# EAGLE schematic A500R8 (EAGLE 7.6.0), part 1 of 2

## Sheet 1 of 9
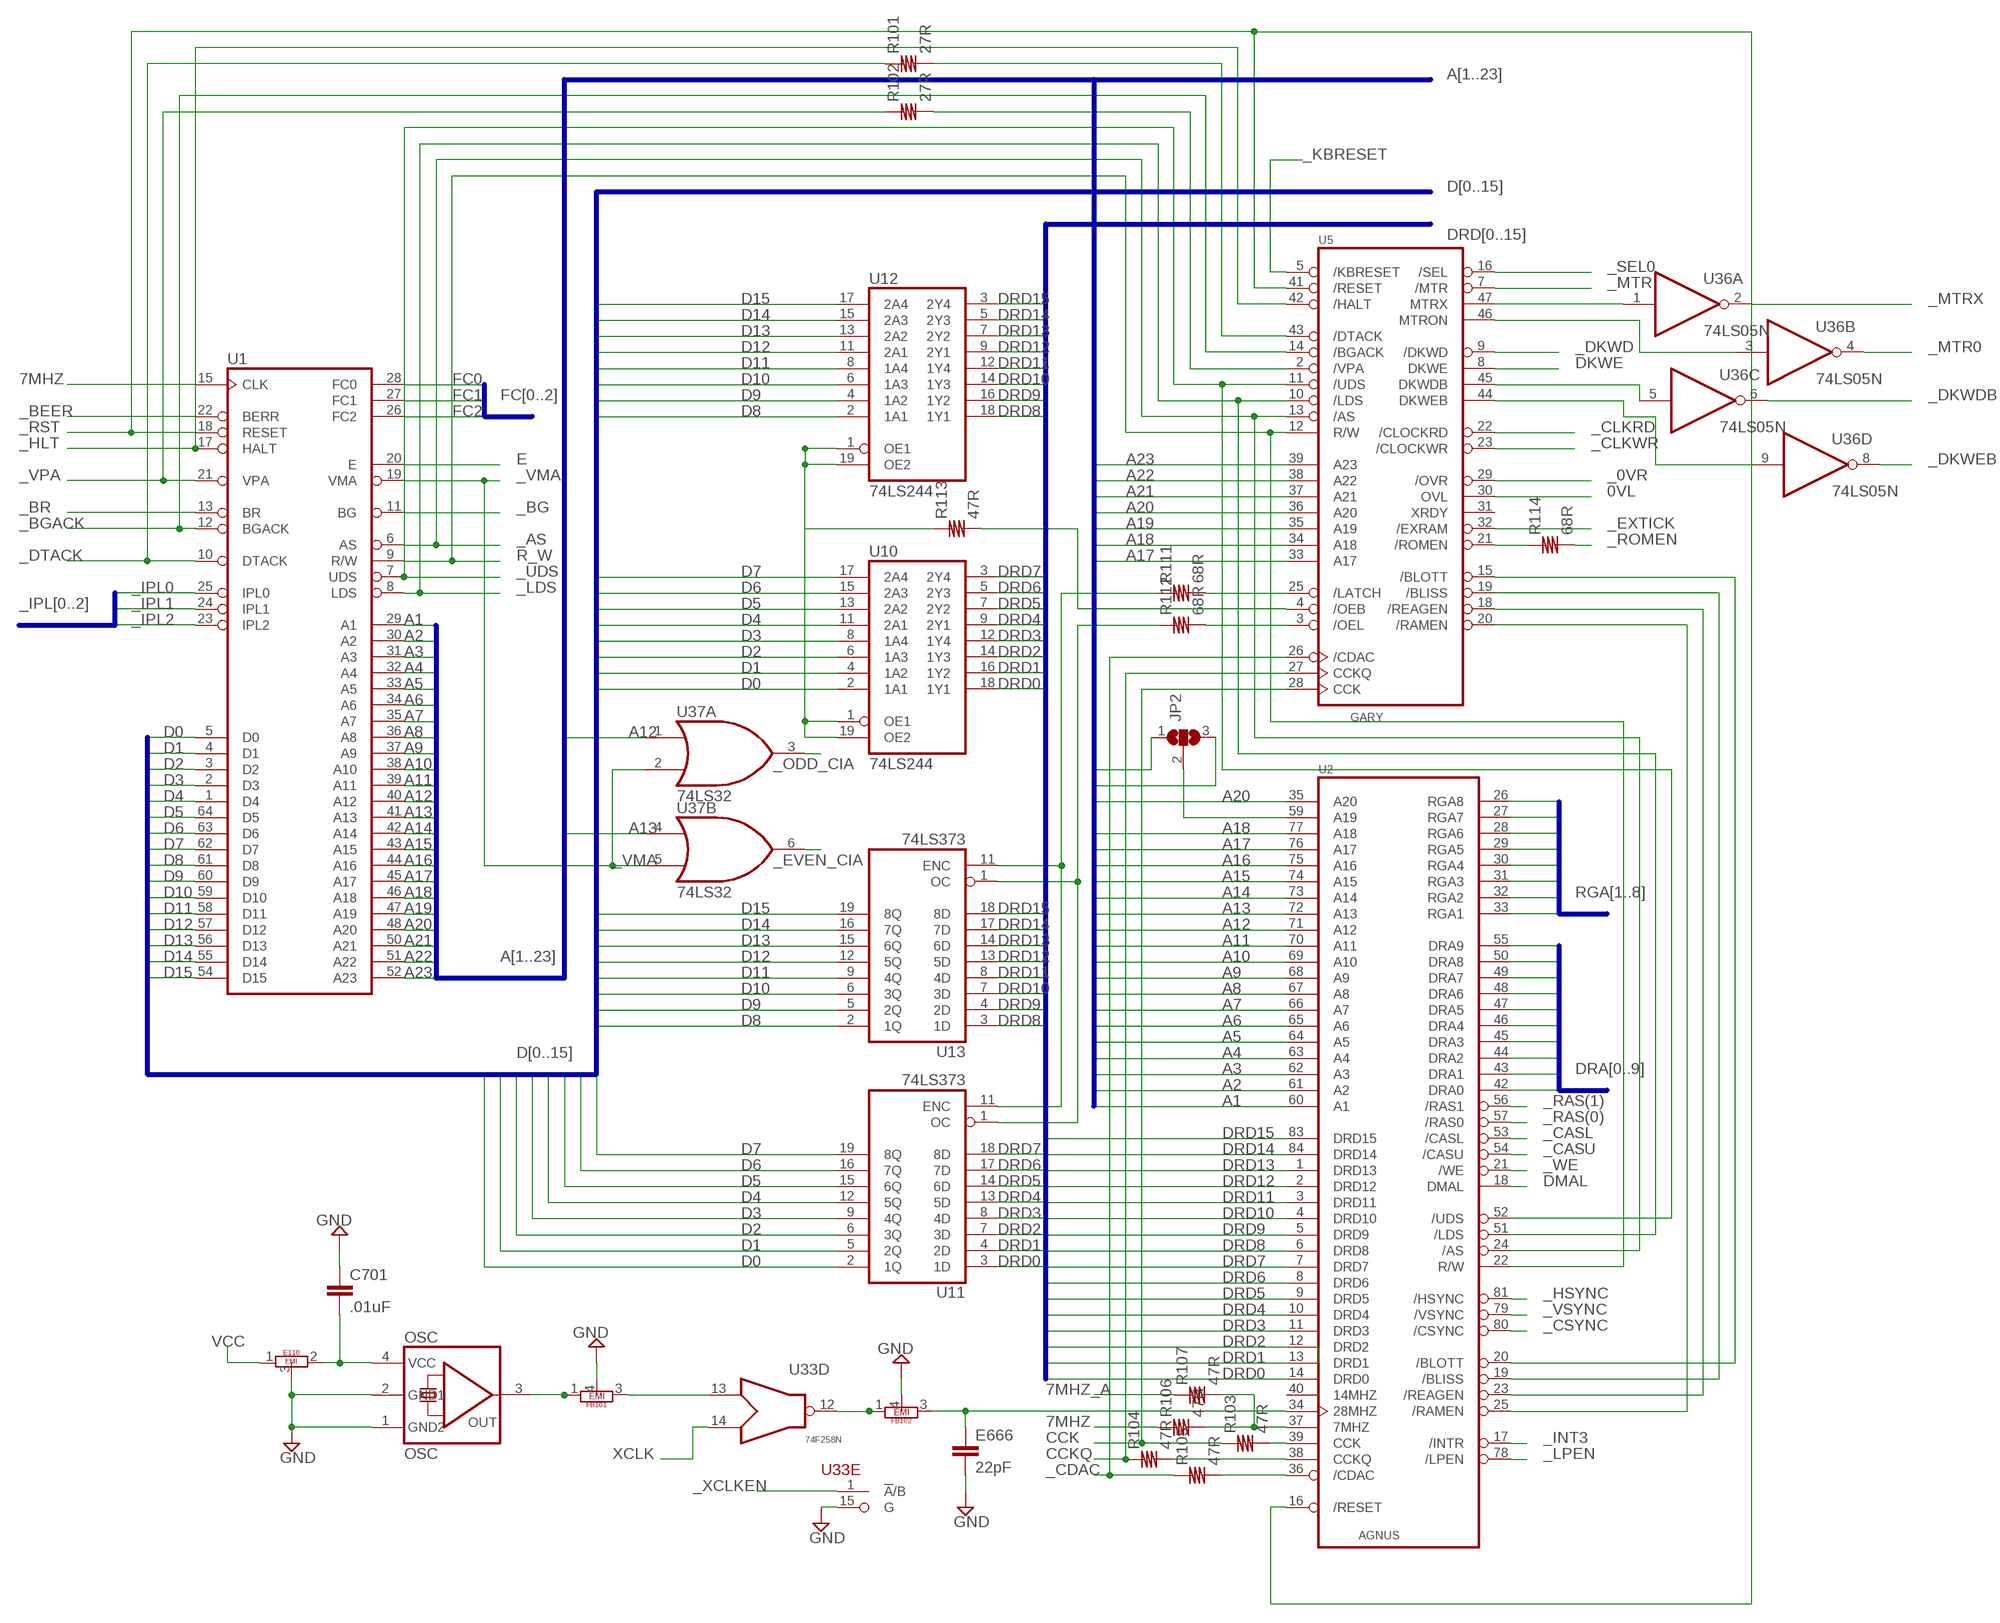
[diagram p0: schematic, sheet 1]

### Parts
C701  .01uF  C10/4  [C10B4]
E110  EMIFILTER  [EMIFILTER]
E666  22pF  C10/4  [C10B4]
FB101  68R  EMIFILTERLONG  [EMIFILTLONG]
FB102  150  EMIFILTERLONG  [EMIFILTLONG]
JP2  SJ2W  [SJ_2]
OSC  OSC  AMIGACRYSTAL  [AMIGACRYSTAL]
R101  27R  R10/4  [R10B4]
R102  27R  R10/4  [R10B4]
R103  47R  R10/4  [R10B4]
R104  47R  R10/4  [R10B4]
R105  47R  R10/4  [R10B4]
R106  47R  R10/4  [R10B4]
R107  47R  R10/4  [R10B4]
R111  68R  R10/4  [R10B4]
R112  68R  R10/4  [R10B4]
R113  47R  R10/4  [R10B4]
R114  68R  R10/4  [R10B4]
U1  MC68000P  [DIL64]
U2  AGNU8375  [PLCC84]
U5  GARY  [DIP48-6]
U10  74LS244  74LS373N  [DIL20]
U11  74LS373  74LS373N  [DIL20]
U12  74LS244  74LS373N  [DIL20]
U13  74LS373  74LS373N  [DIL20]
U33  74F258N  [DIL16]
U36  74LS05N  [DIL14]
U37  74LS32  74LS32N  [DIL14]

### Nets
0VL: U5.30(OVL) ; also sheet 5,8
7MHZ: R106.1 U1.15(CLK) ; also sheet 8,9
7MHZ_A: R107.1 ; also sheet 3,9
_0VR: U5.29(/OVR) ; also sheet 8
_AS: U1.6(AS) U2.24(/AS) U5.13(/AS) ; also sheet 8
_BEER: U1.22(BERR) ; also sheet 8
_BG: U1.11(BG) ; also sheet 8
_BGACK: U1.12(BGACK) U5.14(/BGACK) ; also sheet 8
_BR: U1.13(BR) ; also sheet 8
_CASL: U2.53(/CASL) ; also sheet 2
_CASU: U2.54(/CASU) ; also sheet 2
_CDAC: R105.1 U5.26(/CDAC) ; also sheet 3,8,9
_CLKRD: U5.22(/CLOCKRD) ; also sheet 7
_CLKWR: U5.23(/CLOCKWR) ; also sheet 7
_CSYNC: U2.80(/CSYNC) ; also sheet 3
_DKWD: U5.9(/DKWD) ; also sheet 4
_DKWDB: U36.6(C:O) ; also sheet 6
_DKWEB: U36.8(D:O) ; also sheet 6
_DTACK: R101.1 U1.10(DTACK) ; also sheet 8
_EVEN_CIA: U37.6(B:O) ; also sheet 5
_EXTICK: U5.32(/EXRAM) ; also sheet 5,7,8
_HLT: U1.17(HALT) U5.42(/HALT) ; also sheet 8
_HSYNC: U2.81(/HSYNC) ; also sheet 3,5
_INT3: U2.17(/INTR) ; also sheet 4
_IPL0: U1.25(IPL0) ; also sheet 4,8
_IPL1: U1.24(IPL1) ; also sheet 4,8
_IPL2: U1.23(IPL2) ; also sheet 4,8
_KBRESET: U5.5(/KBRESET) ; also sheet 6
_LDS: U1.8(LDS) U2.51(/LDS) U5.10(/LDS) ; also sheet 8
_LPEN: U2.78(/LPEN) ; also sheet 4
_MTR: U5.7(/MTR) ; also sheet 5
_MTR0: U36.4(B:O) ; also sheet 6
_MTRX: U36.2(A:O) ; also sheet 6
_ODD_CIA: U37.3(A:O) ; also sheet 5
_RAS(0): U2.57(/RAS0) ; also sheet 2
_RAS(1): U2.56(/RAS1) ; also sheet 2
_ROMEN: R114.2 ; also sheet 7
_RST: U1.18(RESET) U2.16(/RESET) U5.41(/RESET) ; also sheet 4,8
_SEL0: U5.16(/SEL) ; also sheet 5,6
_UDS: U1.7(UDS) U2.52(/UDS) U5.11(/UDS) ; also sheet 8
_VMA: U1.19(VMA) U37.2(A:I1) U37.5(B:I1) ; also sheet 8
_VPA: R102.1 U1.21(VPA) ; also sheet 8
_VSYNC: U2.79(/VSYNC) ; also sheet 3,5
_WE: U2.21(/WE) ; also sheet 2
_XCLKEN: U33.1(E:!A!/B) ; also sheet 3
A1: U1.29(A1) U2.60(A1) ; also sheet 7,8
A2: U1.30(A2) U2.61(A2) ; also sheet 7,8
A3: U1.31(A3) U2.62(A3) ; also sheet 7,8
A4: U1.32(A4) U2.63(A4) ; also sheet 7,8
A5: U1.33(A5) U2.64(A5) ; also sheet 7,8
A6: U1.34(A6) U2.65(A6) ; also sheet 7,8
A7: U1.35(A7) U2.66(A7) ; also sheet 7,8
A8: U1.36(A8) U2.67(A8) ; also sheet 5,7,8
A9: U1.37(A9) U2.68(A9) ; also sheet 5,7,8
A10: U1.38(A10) U2.69(A10) ; also sheet 5,7,8
A11: U1.39(A11) U2.70(A11) ; also sheet 5,7,8
A12: U1.40(A12) U2.71(A12) U37.1(A:I0) ; also sheet 7,8
A13: U1.41(A13) U2.72(A13) U37.4(B:I0) ; also sheet 7,8
A14: U1.42(A14) U2.73(A14) ; also sheet 7,8
A15: U1.43(A15) U2.74(A15) ; also sheet 7,8
A16: U1.44(A16) U2.75(A16) ; also sheet 7,8
A17: U1.45(A17) U2.76(A17) U5.33(A17) ; also sheet 7,8
A18: U1.46(A18) U2.77(A18) U5.34(A18) ; also sheet 7,8
A19: JP2.3 U1.47(A19) U5.35(A19) ; also sheet 7,8
A20: U1.48(A20) U2.35(A20) U5.36(A20) ; also sheet 7,8
A21: U1.50(A21) U5.37(A21) ; also sheet 8
A22: U1.51(A22) U5.38(A22) ; also sheet 8
A23: JP2.1 U1.52(A23) U5.39(A23) ; also sheet 8
CCK: R103.1 U5.28(CCK) ; also sheet 2,3,4,8,9
CCKQ: R104.1 U5.27(CCKQ) ; also sheet 4,8,9
D0: U1.5(D0) U10.2(1A1) U11.2(1Q) ; also sheet 5,7,8
D1: U1.4(D1) U10.4(1A2) U11.5(2Q) ; also sheet 5,7,8
D2: U1.3(D2) U10.6(1A3) U11.6(3Q) ; also sheet 5,7,8
D3: U1.2(D3) U10.8(1A4) U11.9(4Q) ; also sheet 5,7,8
D4: U1.1(D4) U10.11(2A1) U11.12(5Q) ; also sheet 5,7,8
D5: U1.64(D5) U10.13(2A2) U11.15(6Q) ; also sheet 5,7,8
D6: U1.63(D6) U10.15(2A3) U11.16(7Q) ; also sheet 5,7,8
D7: U1.62(D7) U10.17(2A4) U11.19(8Q) ; also sheet 5,7,8
D8: U1.61(D8) U12.2(1A1) U13.2(1Q) ; also sheet 5,7,8
D9: U1.60(D9) U12.4(1A2) U13.5(2Q) ; also sheet 5,7,8
D10: U1.59(D10) U12.6(1A3) U13.6(3Q) ; also sheet 5,7,8
D11: U1.58(D11) U12.8(1A4) U13.9(4Q) ; also sheet 5,7,8
D12: U1.57(D12) U12.11(2A1) U13.12(5Q) ; also sheet 5,7,8
D13: U1.56(D13) U12.13(2A2) U13.15(6Q) ; also sheet 5,7,8
D14: U1.55(D14) U12.15(2A3) U13.16(7Q) ; also sheet 5,7,8
D15: U1.54(D15) U12.17(2A4) U13.19(8Q) ; also sheet 5,7,8
DKWE: U5.8(DKWE) ; also sheet 4
DMAL: U2.18(DMAL) ; also sheet 4
DRA0: U2.42(DRA0) ; also sheet 2
DRA1: U2.43(DRA1) ; also sheet 2
DRA2: U2.44(DRA2) ; also sheet 2
DRA3: U2.45(DRA3) ; also sheet 2
DRA4: U2.46(DRA4) ; also sheet 2
DRA5: U2.47(DRA5) ; also sheet 2
DRA6: U2.48(DRA6) ; also sheet 2
DRA7: U2.49(DRA7) ; also sheet 2
DRA8: U2.50(DRA8) ; also sheet 2
DRA9: U2.55(DRA9) ; also sheet 2
DRD0: U2.14(DRD0) U10.18(1Y1) U11.3(1D) ; also sheet 2,3,4,7,8
DRD1: U2.13(DRD1) U10.16(1Y2) U11.4(2D) ; also sheet 2,3,4,7,8
DRD2: U2.12(DRD2) U10.14(1Y3) U11.7(3D) ; also sheet 2,3,4,7,8
DRD3: U2.11(DRD3) U10.12(1Y4) U11.8(4D) ; also sheet 2,3,4,7,8
DRD4: U2.10(DRD4) U10.9(2Y1) U11.13(5D) ; also sheet 2,3,4,7,8
DRD5: U2.9(DRD5) U10.7(2Y2) U11.14(6D) ; also sheet 2,3,4,7,8
DRD6: U2.8(DRD6) U10.5(2Y3) U11.17(7D) ; also sheet 2,3,4,7,8
DRD7: U2.7(DRD7) U10.3(2Y4) U11.18(8D) ; also sheet 2,3,4,7,8
DRD8: U2.6(DRD8) U12.18(1Y1) U13.3(1D) ; also sheet 2,3,4,7,8
DRD9: U2.5(DRD9) U12.16(1Y2) U13.4(2D) ; also sheet 2,3,4,7,8
DRD10: U2.4(DRD10) U12.14(1Y3) U13.7(3D) ; also sheet 2,3,4,7,8
DRD11: U2.3(DRD11) U12.12(1Y4) U13.8(4D) ; also sheet 2,3,4,7,8
DRD12: U2.2(DRD12) U12.9(2Y1) U13.13(5D) ; also sheet 2,3,4,7,8
DRD13: U2.1(DRD13) U12.7(2Y2) U13.14(6D) ; also sheet 2,3,4,7,8
DRD14: U2.84(DRD14) U12.5(2Y3) U13.17(7D) ; also sheet 2,3,4,7,8
DRD15: U2.83(DRD15) U12.3(2Y4) U13.18(8D) ; also sheet 2,3,4,7,8
E: U1.20(E) ; also sheet 5,8
FC0: U1.28(FC0) ; also sheet 8
FC1: U1.27(FC1) ; also sheet 8
FC2: U1.26(FC2) ; also sheet 8
GND: C701.1 E110.3 E666.2 FB101.4 FB102.4 OSC.1(GND2) OSC.2(GND1) U33.15(E:G) ; also sheet 2,3,4,5,6,7,8,9
N$1: R113.1 U10.1(OE1) U10.19(OE2) U12.1(OE1) U12.19(OE2)
N$2: R113.2 U5.4(/OEB)
N$3: R112.1 U11.1(OC) U13.1(OC)
N$4: R112.2 U5.3(/OEL)
N$5: R111.1 U11.11(ENC) U13.11(ENC)
N$6: R111.2 U5.25(/LATCH)
N$7: R102.2 U5.2(/VPA)
N$8: R114.1 U5.21(/ROMEN)
N$9: U5.47(MTRX) U36.1(A:I)
N$10: R101.2 U5.43(/DTACK)
N$11: R106.2 R107.2 U2.37(7MHZ)
N$12: R103.2 U2.39(CCK)
N$13: R104.2 U2.38(CCKQ)
N$14: R105.2 U2.36(/CDAC)
N$15: U2.20(/BLOTT) U5.15(/BLOTT)
N$16: U2.19(/BLISS) U5.19(/BLISS)
N$17: U2.23(/REAGEN) U5.18(/REAGEN)
N$18: U2.25(/RAMEN) U5.20(/RAMEN)
N$19: E666.1 FB102.3 U2.34(28MHZ)
N$20: JP2.2 U2.59(A19)
N$192: U5.46(MTRON) U36.3(B:I)
N$198: U5.45(DKWDB) U36.5(C:I)
N$203: U5.44(DKWEB) U36.9(D:I)
N$232: FB102.1 FB102.2 U33.12(D:O)
N$236: FB101.1 FB101.2 OSC.3(OUT)
N$237: FB101.3 U33.13(D:I0)
N$254: C701.2 E110.2 OSC.4(VCC)
R_W: U1.9(R/W) U2.22(R/W) U5.12(R/W) ; also sheet 5,8
RGA1: U2.33(RGA1) ; also sheet 3,4
RGA2: U2.32(RGA2) ; also sheet 3,4
RGA3: U2.31(RGA3) ; also sheet 3,4
RGA4: U2.30(RGA4) ; also sheet 3,4
RGA5: U2.29(RGA5) ; also sheet 3,4
RGA6: U2.28(RGA6) ; also sheet 3,4
RGA7: U2.27(RGA7) ; also sheet 3,4
RGA8: U2.26(RGA8) ; also sheet 3,4
VCC: E110.1 ; also sheet 2,3,4,5,6,7,8,9
XCLK: U33.14(D:I1) ; also sheet 3
Unconnected: U2.40(14MHZ) U5.31(XRDY)

### Buses
_IPL[0..2]
FC[0..2]
D[0..15]
A[1..23]
DRD[0..15]
RGA[1..8]
DRA[0..9]

## Sheet 2 of 9
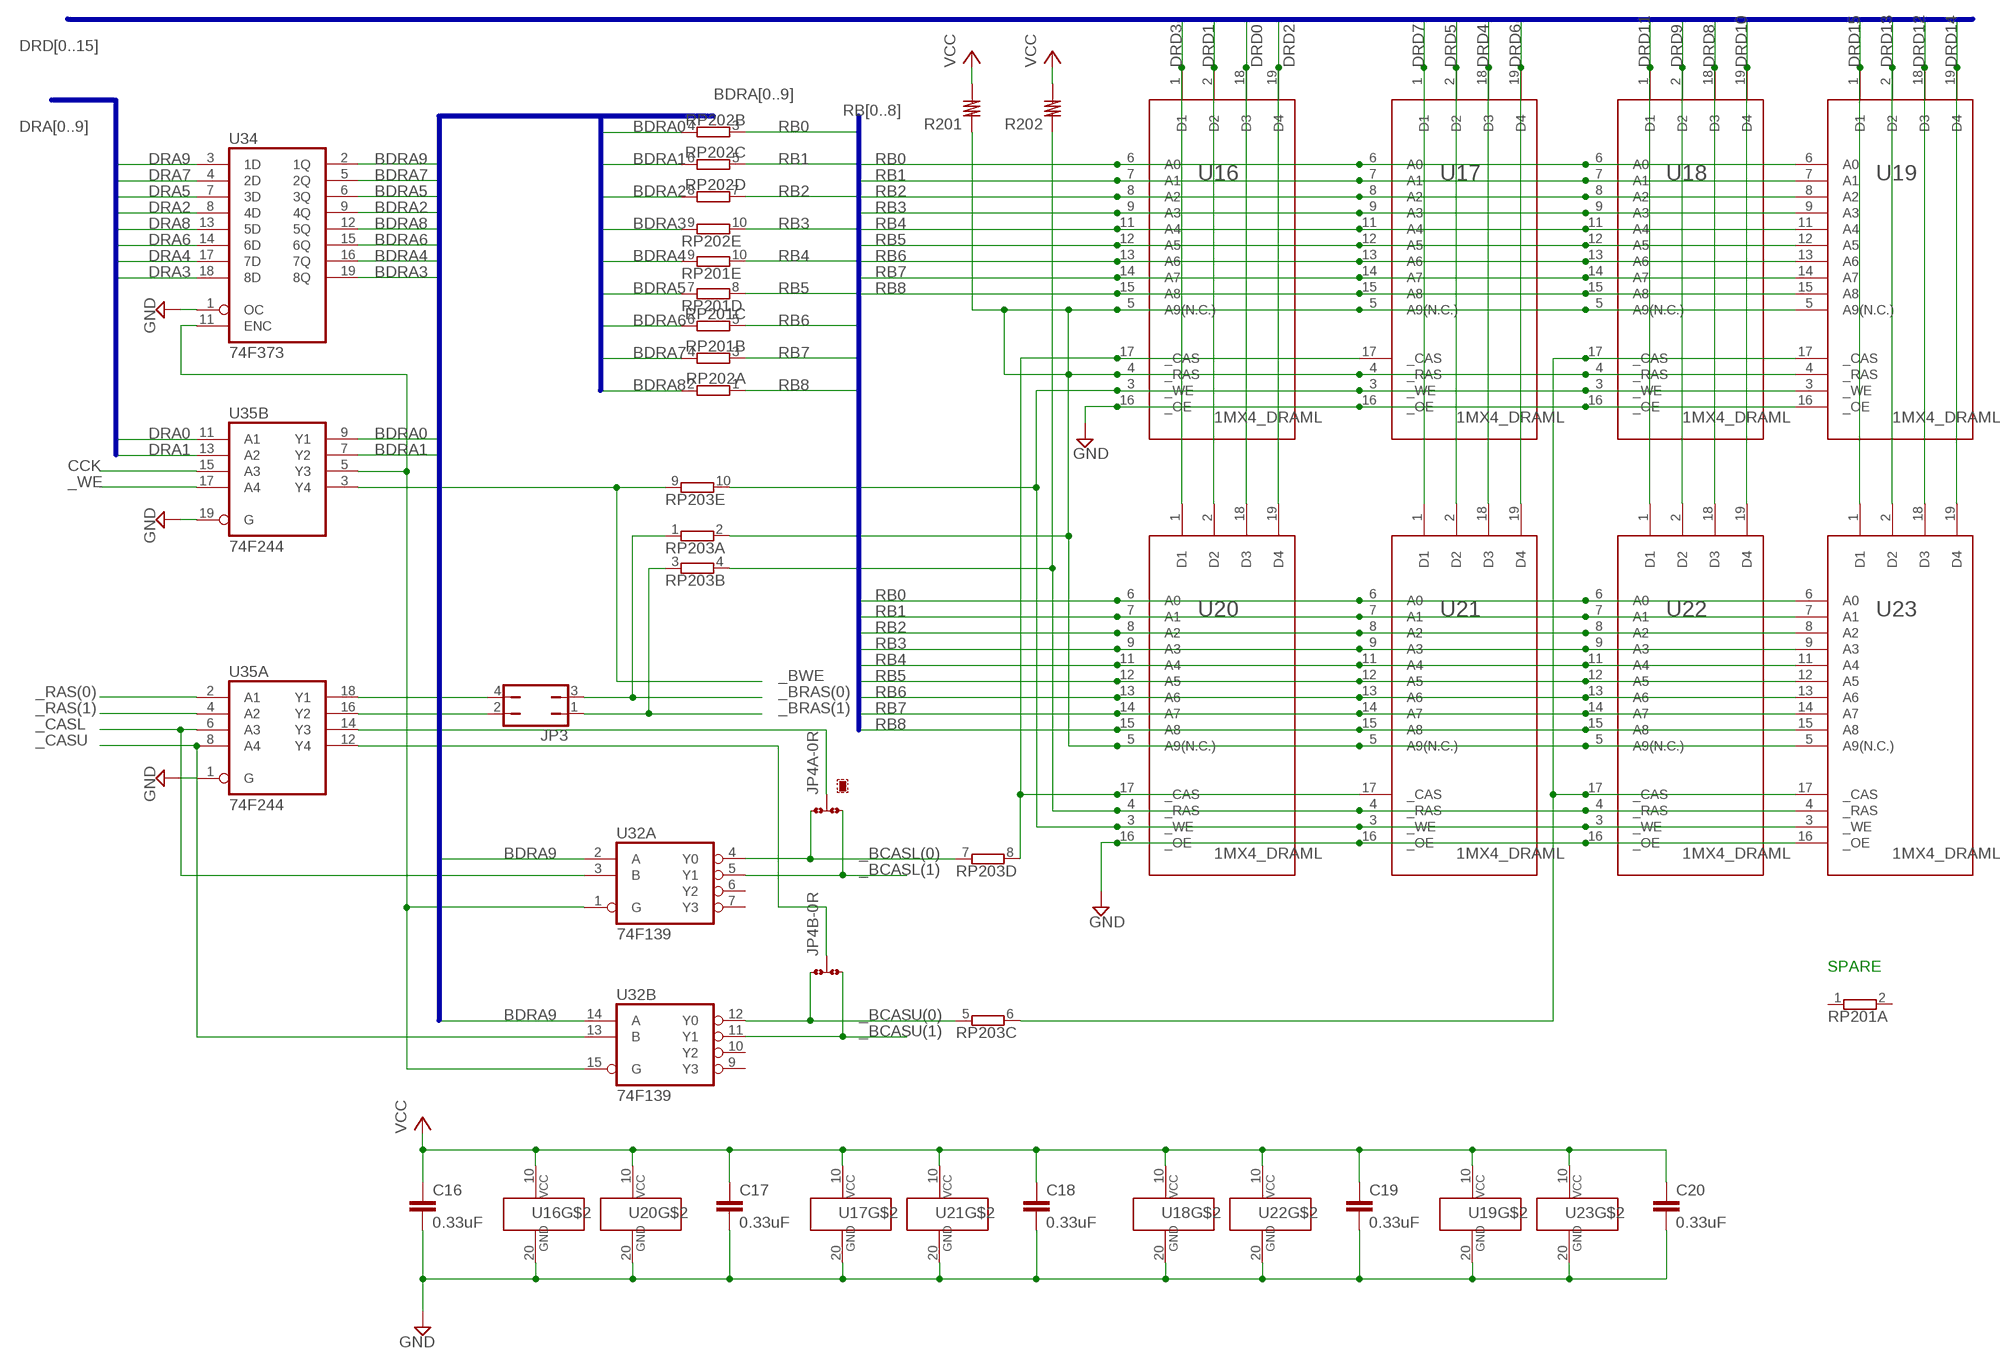
[diagram p1: schematic, sheet 2]

### Parts
C16  0.33uF  C10/4  [C10B4]
C17  0.33uF  C10/4  [C10B4]
C18  0.33uF  C10/4  [C10B4]
C19  0.33uF  C10/4  [C10B4]
C20  0.33uF  C10/4  [C10B4]
JP3  JP2Q  [JP2Q]
JP4A  JP4A  0R-JUMPA  [A0R-JMP]
JP4B  JP4B  0R-JUMPA  [A0R-JMP]
R201  R10/4  [R10B4]
R202  R10/4  [R10B4]
RP201  E5R  [SIL10]
RP202  E5R  [SIL10]
RP203  E5R  [SIL10]
U16  1MX4_DRAML  [DIL20]
U17  1MX4_DRAML  [DIL20]
U18  1MX4_DRAML  [DIL20]
U19  1MX4_DRAML  [DIL20]
U20  1MX4_DRAML  [DIL20]
U21  1MX4_DRAML  [DIL20]
U22  1MX4_DRAML  [DIL20]
U23  1MX4_DRAML  [DIL20]
U32  74F139  74S139N  [DIL16]
U34  74F373  74LS373N  [DIL20]
U35  74F244  74S244N  [DIL20]

### Nets
_BCASL(0): JP4A.1 RP203.7 U32.4(A:Y0)
_BCASL(1): JP4A.3 U32.5(A:Y1) ; also sheet 7
_BCASU(0): JP4B.1 RP203.5 U32.12(B:Y0)
_BCASU(1): JP4B.3 U32.11(B:Y1) ; also sheet 7
_BRAS(0): JP3.3 RP203.1 ; also sheet 7
_BRAS(1): JP3.1 RP203.3 ; also sheet 7
_BWE: RP203.9 U35.3(B:Y4) ; also sheet 7
_CASL: U32.3(A:B) U35.6(A:A3) ; also sheet 1
_CASU: U32.13(B:B) U35.8(A:A4) ; also sheet 1
_RAS(0): U35.2(A:A1) ; also sheet 1
_RAS(1): U35.4(A:A2) ; also sheet 1
_WE: U35.17(B:A4) ; also sheet 1
BDRA0: RP202.4 U35.9(B:Y1) ; also sheet 7
BDRA1: RP202.6 U35.7(B:Y2) ; also sheet 7
BDRA2: RP202.8 U34.9(4Q) ; also sheet 7
BDRA3: RP202.9 U34.19(8Q) ; also sheet 7
BDRA4: RP201.9 U34.16(7Q) ; also sheet 7
BDRA5: RP201.7 U34.6(3Q) ; also sheet 7
BDRA6: RP201.6 U34.15(6Q) ; also sheet 7
BDRA7: RP201.4 U34.5(2Q) ; also sheet 7
BDRA8: RP202.2 U34.12(5Q) ; also sheet 7
BDRA9: U32.2(A:A) U32.14(B:A) U34.2(1Q)
CCK: U35.15(B:A3) ; also sheet 1,3,4,8,9
DRA0: U35.11(B:A1) ; also sheet 1
DRA1: U35.13(B:A2) ; also sheet 1
DRA2: U34.8(4D) ; also sheet 1
DRA3: U34.18(8D) ; also sheet 1
DRA4: U34.17(7D) ; also sheet 1
DRA5: U34.7(3D) ; also sheet 1
DRA6: U34.14(6D) ; also sheet 1
DRA7: U34.4(2D) ; also sheet 1
DRA8: U34.13(5D) ; also sheet 1
DRA9: U34.3(1D) ; also sheet 1
DRD0: U16.18(D3) U20.18(D3) ; also sheet 1,3,4,7,8
DRD1: U16.2(D2) U20.2(D2) ; also sheet 1,3,4,7,8
DRD2: U16.19(D4) U20.19(D4) ; also sheet 1,3,4,7,8
DRD3: U16.1(D1) U20.1(D1) ; also sheet 1,3,4,7,8
DRD4: U17.18(D3) U21.18(D3) ; also sheet 1,3,4,7,8
DRD5: U17.2(D2) U21.2(D2) ; also sheet 1,3,4,7,8
DRD6: U17.19(D4) U21.19(D4) ; also sheet 1,3,4,7,8
DRD7: U17.1(D1) U21.1(D1) ; also sheet 1,3,4,7,8
DRD8: U18.18(D3) U22.18(D3) ; also sheet 1,3,4,7,8
DRD9: U18.2(D2) U22.2(D2) ; also sheet 1,3,4,7,8
DRD10: U18.19(D4) U22.19(D4) ; also sheet 1,3,4,7,8
DRD11: U18.1(D1) U22.1(D1) ; also sheet 1,3,4,7,8
DRD12: U19.18(D3) U23.18(D3) ; also sheet 1,3,4,7,8
DRD13: U19.2(D2) U23.2(D2) ; also sheet 1,3,4,7,8
DRD14: U19.19(D4) U23.19(D4) ; also sheet 1,3,4,7,8
DRD15: U19.1(D1) U23.1(D1) ; also sheet 1,3,4,7,8
GND: C16.2 C17.2 C18.2 C19.2 C20.2 U16.16(_OE) U16.20(GND1) U17.16(_OE) U17.20(GND1) U18.16(_OE) U18.20(GND1) U19.16(_OE) U19.20(GND1) U20.16(_OE) U20.20(GND1) U21.16(_OE) U21.20(GND1) U22.16(_OE) U22.20(GND1) U23.16(_OE) U23.20(GND1) U34.1(OC) U35.1(A:G) U35.19(B:G) ; also sheet 1,3,4,5,6,7,8,9
N$21: U32.1(A:G) U32.15(B:G) U34.11(ENC) U35.5(B:Y3)
N$22: JP3.4 U35.18(A:Y1)
N$23: JP3.2 U35.16(A:Y2)
N$24: JP4A.2 U35.14(A:Y3)
N$25: JP4B.2 U35.12(A:Y4)
N$26: R202.1 RP203.4 U20.4(_RAS) U21.4(_RAS) U22.4(_RAS) U23.4(_RAS)
N$27: RP203.6 U18.17(_CAS) U19.17(_CAS) U22.17(_CAS) U23.17(_CAS)
N$28: RP203.8 U16.17(_CAS) U17.17(_CAS) U20.17(_CAS) U21.17(_CAS)
N$29: RP203.10 U16.3(_WE) U17.3(_WE) U18.3(_WE) U19.3(_WE) U20.3(_WE) U21.3(_WE) U22.3(_WE) U23.3(_WE)
N$30: R201.1 RP203.2 U16.4(_RAS) U16.5(A9(N.C.)) U17.4(_RAS) U17.5(A9(N.C.)) U18.4(_RAS) U18.5(A9(N.C.)) U19.4(_RAS) U19.5(A9(N.C.)) U20.5(A9(N.C.)) U21.5(A9(N.C.)) U22.5(A9(N.C.)) U23.5(A9(N.C.))
RB0: RP202.3 U16.6(A0) U17.6(A0) U18.6(A0) U19.6(A0) U20.6(A0) U21.6(A0) U22.6(A0) U23.6(A0)
RB1: RP202.5 U16.7(A1) U17.7(A1) U18.7(A1) U19.7(A1) U20.7(A1) U21.7(A1) U22.7(A1) U23.7(A1)
RB2: RP202.7 U16.8(A2) U17.8(A2) U18.8(A2) U19.8(A2) U20.8(A2) U21.8(A2) U22.8(A2) U23.8(A2)
RB3: RP202.10 U16.9(A3) U17.9(A3) U18.9(A3) U19.9(A3) U20.9(A3) U21.9(A3) U22.9(A3) U23.9(A3)
RB4: RP201.10 U16.11(A4) U17.11(A4) U18.11(A4) U19.11(A4) U20.11(A4) U21.11(A4) U22.11(A4) U23.11(A4)
RB5: RP201.8 U16.12(A5) U17.12(A5) U18.12(A5) U19.12(A5) U20.12(A5) U21.12(A5) U22.12(A5) U23.12(A5)
RB6: RP201.5 U16.13(A6) U17.13(A6) U18.13(A6) U19.13(A6) U20.13(A6) U21.13(A6) U22.13(A6) U23.13(A6)
RB7: RP201.3 U16.14(A7) U17.14(A7) U18.14(A7) U19.14(A7) U20.14(A7) U21.14(A7) U22.14(A7) U23.14(A7)
RB8: RP202.1 U16.15(A8) U17.15(A8) U18.15(A8) U19.15(A8) U20.15(A8) U21.15(A8) U22.15(A8) U23.15(A8)
VCC: C16.1 C17.1 C18.1 C19.1 C20.1 R201.2 R202.2 U16.10(VCC1) U17.10(VCC1) U18.10(VCC1) U19.10(VCC1) U20.10(VCC1) U21.10(VCC1) U22.10(VCC1) U23.10(VCC1) ; also sheet 1,3,4,5,6,7,8,9
Unconnected: RP201.1 RP201.2 U32.6(A:Y2) U32.7(A:Y3) U32.9(B:Y3) U32.10(B:Y2)

### Buses
DRA[0..9]
DRD[0..15]
BDRA[0..9]
RB[0..8]

### Notes on the sheet
- SPARE

## Sheet 3 of 9
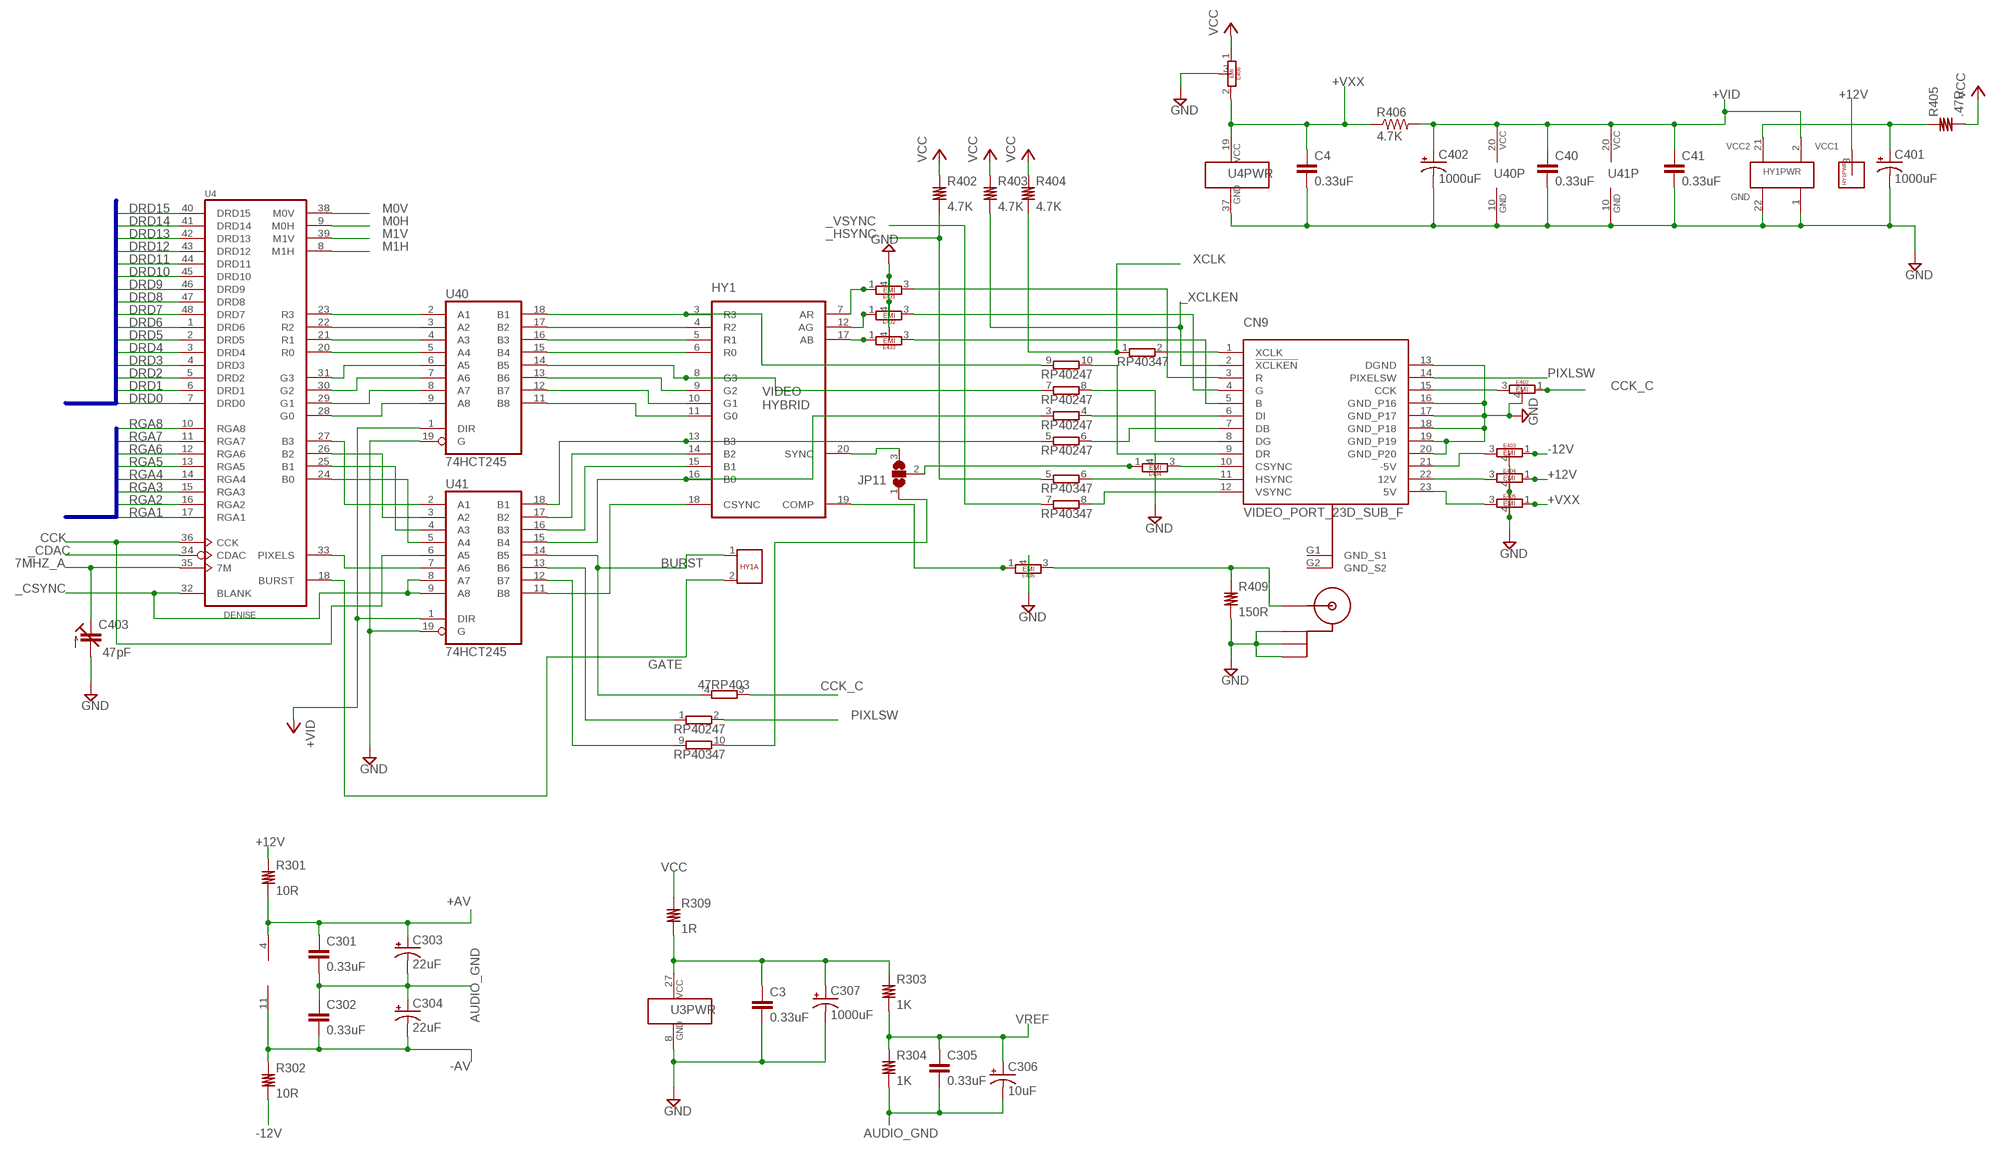
[diagram p2: schematic, sheet 3]

### Parts
C3  0.33uF  C10/4  [C10B4]
C4  0.33uF  C10/4  [C10B4]
C40  0.33uF  C10/4  [C10B4]
C41  0.33uF  C10/4  [C10B4]
C301  0.33uF  C10/4  [C10B4]
C302  0.33uF  C10/4  [C10B4]
C303  22uF  CPOL-USE5-6  [E5-6]
C304  22uF  CPOL-USE5-6  [E5-6]
C305  0.33uF  C10/4  [C10B4]
C306  10uF  CPOL-USE5-6  [E5-6]
C307  1000uF  CPOL-USE5-6  [E5-6]
C401  1000uF  CPOL-USE5-10.5  [E5-10,5]
C402  1000uF  CPOL-USE5-10.5  [E5-10,5]
C403  47pF  C-TRIMM3050.504  [CTRIM3050.504]
CN9  VIDEO_PORT_23D_SUB_F  [F23H_FC]
CN10  CINCH  [CINCH-B]
E402  150pF  EMIFILTERLONG  [EMIFILTLONG]
E403  EMIFILTERLONG  [EMIFILTLONG]
E404  EMIFILTERLONG  [EMIFILTLONG]
E405  EMIFILTERLONG  [EMIFILTLONG]
E406  EMIFILTER  [EMIFILTER]
E431  EMIFILTERLONG  [EMIFILTLONG]
E432  EMIFILTERLONG  [EMIFILTLONG]
E433  EMIFILTERLONG  [EMIFILTLONG]
E434  EMIFILTERLONG  [EMIFILTLONG]
E435  EMIFILTERLONG  [EMIFILTLONG]
HY1  HY1  VIDEO_H  [SIP22]
JP11  SJ2W  [SJ_2]
R301  10R  R10/4  [R10B4]
R302  10R  R10/4  [R10B4]
R303  1K  R10/4  [R10B4]
R304  1K  R10/4  [R10B4]
R309  1R  R10/4  [R10B4]
R402  4.7K  R10/4  [R10B4]
R403  4.7K  R10/4  [R10B4]
R404  4.7K  R10/4  [R10B4]
R405  .47R  R10/4  [R10B4]
R406  4.7K  R-US_0207/10  [0207/10]
R409  150R  R10/4  [R10B4]
RP402  47  E5RP  [SIL10]
RP403  47  E5RP  [SIL10]
U3  PAULA_DIP  [DIP48-6]
U4  DENISE HR  DENISE_DIP  [DIP48-6]
U14  LF347/TL084  ICL7641P  [DIL14]
U40  74HCT245  74LS245N  [DIL20]
U41  74HCT245  74LS245N  [DIL20]
U$1  HY1A  [HY1A]

### Nets
7MHZ_A: C403.1(E) U4.35(7M) ; also sheet 1,9
+12V: E404.1 E404.2 R301.1 U$1.3 ; also sheet 5,6,7,8,9
+AV: C301.1 C303.+ R301.2 U14.4(P:V+) ; also sheet 4
+VID: C40.1 C41.1 C402.+ HY1.2(VCC) R406.2 U40.1(DIR) U40.20(VCC) U41.1(DIR) U41.20(VCC)
+VXX: C4.1 E405.1 E405.2 E406.2 R406.1 U4.19(VCC1)
-12V: E403.1 E403.2 R302.2 ; also sheet 4,5,7,8,9
-AV: C302.2 C304.- R302.1 U14.11(P:V-) ; also sheet 4
_CDAC: U4.34(CDAC) ; also sheet 1,8,9
_CSYNC: U4.32(BLANK) U41.8(A7) U41.9(A8) ; also sheet 1
_HSYNC: R402.2 RP403.5 ; also sheet 1,5
_VSYNC: RP403.7 ; also sheet 1,5
_XCLKEN: CN9.2(!XCLKEN!) R403.2 ; also sheet 1
AUDIO_GND: C301.2 C302.1 C303.- C304.+ C305.2 C306.- R304.2 ; also sheet 4
BURST: RP403.4 U41.14(B5) U$1.1
CCK: U4.36(CCK) U41.6(A5) ; also sheet 1,2,4,8,9
CCK_C: E402.1 E402.2 RP403.3
DRD0: U4.7(DRD0) ; also sheet 1,2,4,7,8
DRD1: U4.6(DRD1) ; also sheet 1,2,4,7,8
DRD2: U4.5(DRD2) ; also sheet 1,2,4,7,8
DRD3: U4.4(DRD3) ; also sheet 1,2,4,7,8
DRD4: U4.3(DRD4) ; also sheet 1,2,4,7,8
DRD5: U4.2(DRD5) ; also sheet 1,2,4,7,8
DRD6: U4.1(DRD6) ; also sheet 1,2,4,7,8
DRD7: U4.48(DRD7) ; also sheet 1,2,4,7,8
DRD8: U4.47(DRD8) ; also sheet 1,2,4,7,8
DRD9: U4.46(DRD9) ; also sheet 1,2,4,7,8
DRD10: U4.45(DRD10) ; also sheet 1,2,4,7,8
DRD11: U4.44(DRD11) ; also sheet 1,2,4,7,8
DRD12: U4.43(DRD12) ; also sheet 1,2,4,7,8
DRD13: U4.42(DRD13) ; also sheet 1,2,4,7,8
DRD14: U4.41(DRD14) ; also sheet 1,2,4,7,8
DRD15: U4.40(DRD15) ; also sheet 1,2,4,7,8
GATE: U4.18(BURST) U$1.2
GND: C3.2 C4.2 C40.2 C41.2 C307.- C401.- C402.- C403.2(A) CN9.13(DGND) CN9.16(GND_P16) CN9.17(GND_P17) CN9.18(GND_P18) CN9.19(GND_P19) CN9.20(GND_P20) CN10.P$2 CN10.P$3 CN10.P$4 E402.4 E403.4 E404.4 E405.4 E406.3 E431.4 E432.4 E433.4 E434.4 E435.4 HY1.1(GND) HY1.22(GND) R409.2 U3.8(GND1) U4.37(GND1) U40.10(GND) U40.19(G) U41.10(GND) U41.19(G) ; also sheet 1,2,4,5,6,7,8,9
M0H: U4.9(M0H) ; also sheet 4
M0V: U4.38(M0V) ; also sheet 4
M1H: U4.8(M1H) ; also sheet 4
M1V: U4.39(M1V) ; also sheet 4
N$31: U4.23(R3) U40.2(A1)
N$32: U4.22(R2) U40.3(A2)
N$33: U4.21(R1) U40.4(A3)
N$34: U4.20(R0) U40.5(A4)
N$35: U4.31(G3) U40.6(A5)
N$36: U4.30(G2) U40.7(A6)
N$37: U4.29(G1) U40.8(A7)
N$38: U4.28(G0) U40.9(A8)
N$39: JP11.1 RP403.10
N$40: U4.26(B2) U41.3(A2)
N$41: U4.27(B3) U41.2(A1)
N$42: U4.25(B1) U41.4(A3)
N$43: U4.24(B0) U41.5(A4)
N$44: U4.33(PIXELS) U41.7(A6)
N$45: C3.1 C307.+ R303.1 R309.2 U3.27(VCC1)
N$46: E434.1 E434.2 JP11.2
N$47: HY1.4(R2) U40.17(B2)
N$48: HY1.5(R1) U40.16(B3)
N$49: HY1.6(R0) U40.15(B4)
N$50: HY1.8(G3) RP402.7 U40.14(B5)
N$51: HY1.9(G2) U40.13(B6)
N$52: HY1.10(G1) U40.12(B7)
N$53: HY1.11(G0) U40.11(B8)
N$54: HY1.13(B3) RP402.5 U41.18(B1)
N$55: HY1.14(B2) U41.17(B2)
N$56: HY1.15(B1) U41.16(B3)
N$58: HY1.18(CSYNC) U41.11(B8)
N$59: HY1.20(SYNC) JP11.3
N$60: RP402.1 U41.13(B6)
N$61: RP403.9 U41.12(B7)
N$62: E435.1 E435.2 HY1.19(COMP)
N$63: CN9.1(XCLK) RP403.2
N$64: CN9.6(DI) RP402.4
N$65: HY1.16(B0) RP402.3 U41.15(B4)
N$66: CN9.7(DB) RP402.6
N$67: CN9.8(DG) RP402.8
N$68: CN9.9(DR) RP402.10
N$69: CN9.10(CSYNC) E434.3
N$70: CN9.11(HSYNC) RP403.6
N$71: CN9.12(VSYNC) RP403.8
N$72: E431.1 E431.2 HY1.7(AR)
N$73: E432.1 E432.2 HY1.12(AG)
N$74: E433.1 E433.2 HY1.17(AB)
N$75: CN9.3(R) E431.3
N$76: CN9.5(B) E433.3
N$77: CN9.4(G) E432.3
N$78: CN10.S E435.3 R409.1
N$79: CN9.15(CCK) E402.3
N$80: CN9.23(5V) E405.3
N$81: CN9.22(12V) E404.3
N$82: CN9.21(-5V) E403.3
N$255: C401.+ HY1.21(VCC) R405.1
N$257: HY1.3(R3) RP402.9 U40.18(B1)
PIXLSW: CN9.14(PIXELSW) RP402.2
RGA1: U4.17(RGA1) ; also sheet 1,4
RGA2: U4.16(RGA2) ; also sheet 1,4
RGA3: U4.15(RGA3) ; also sheet 1,4
RGA4: U4.14(RGA4) ; also sheet 1,4
RGA5: U4.13(RGA5) ; also sheet 1,4
RGA6: U4.12(RGA6) ; also sheet 1,4
RGA7: U4.11(RGA7) ; also sheet 1,4
RGA8: U4.10(RGA8) ; also sheet 1,4
VCC: E406.1 R309.1 R402.1 R403.1 R404.1 R405.2 ; also sheet 1,2,4,5,6,7,8,9
VREF: C305.1 C306.+ R303.2 R304.1 ; also sheet 4
XCLK: R404.2 RP403.1 ; also sheet 1

### Buses
DRD[0..15]
RGA[1..8]

## Sheet 4 of 9
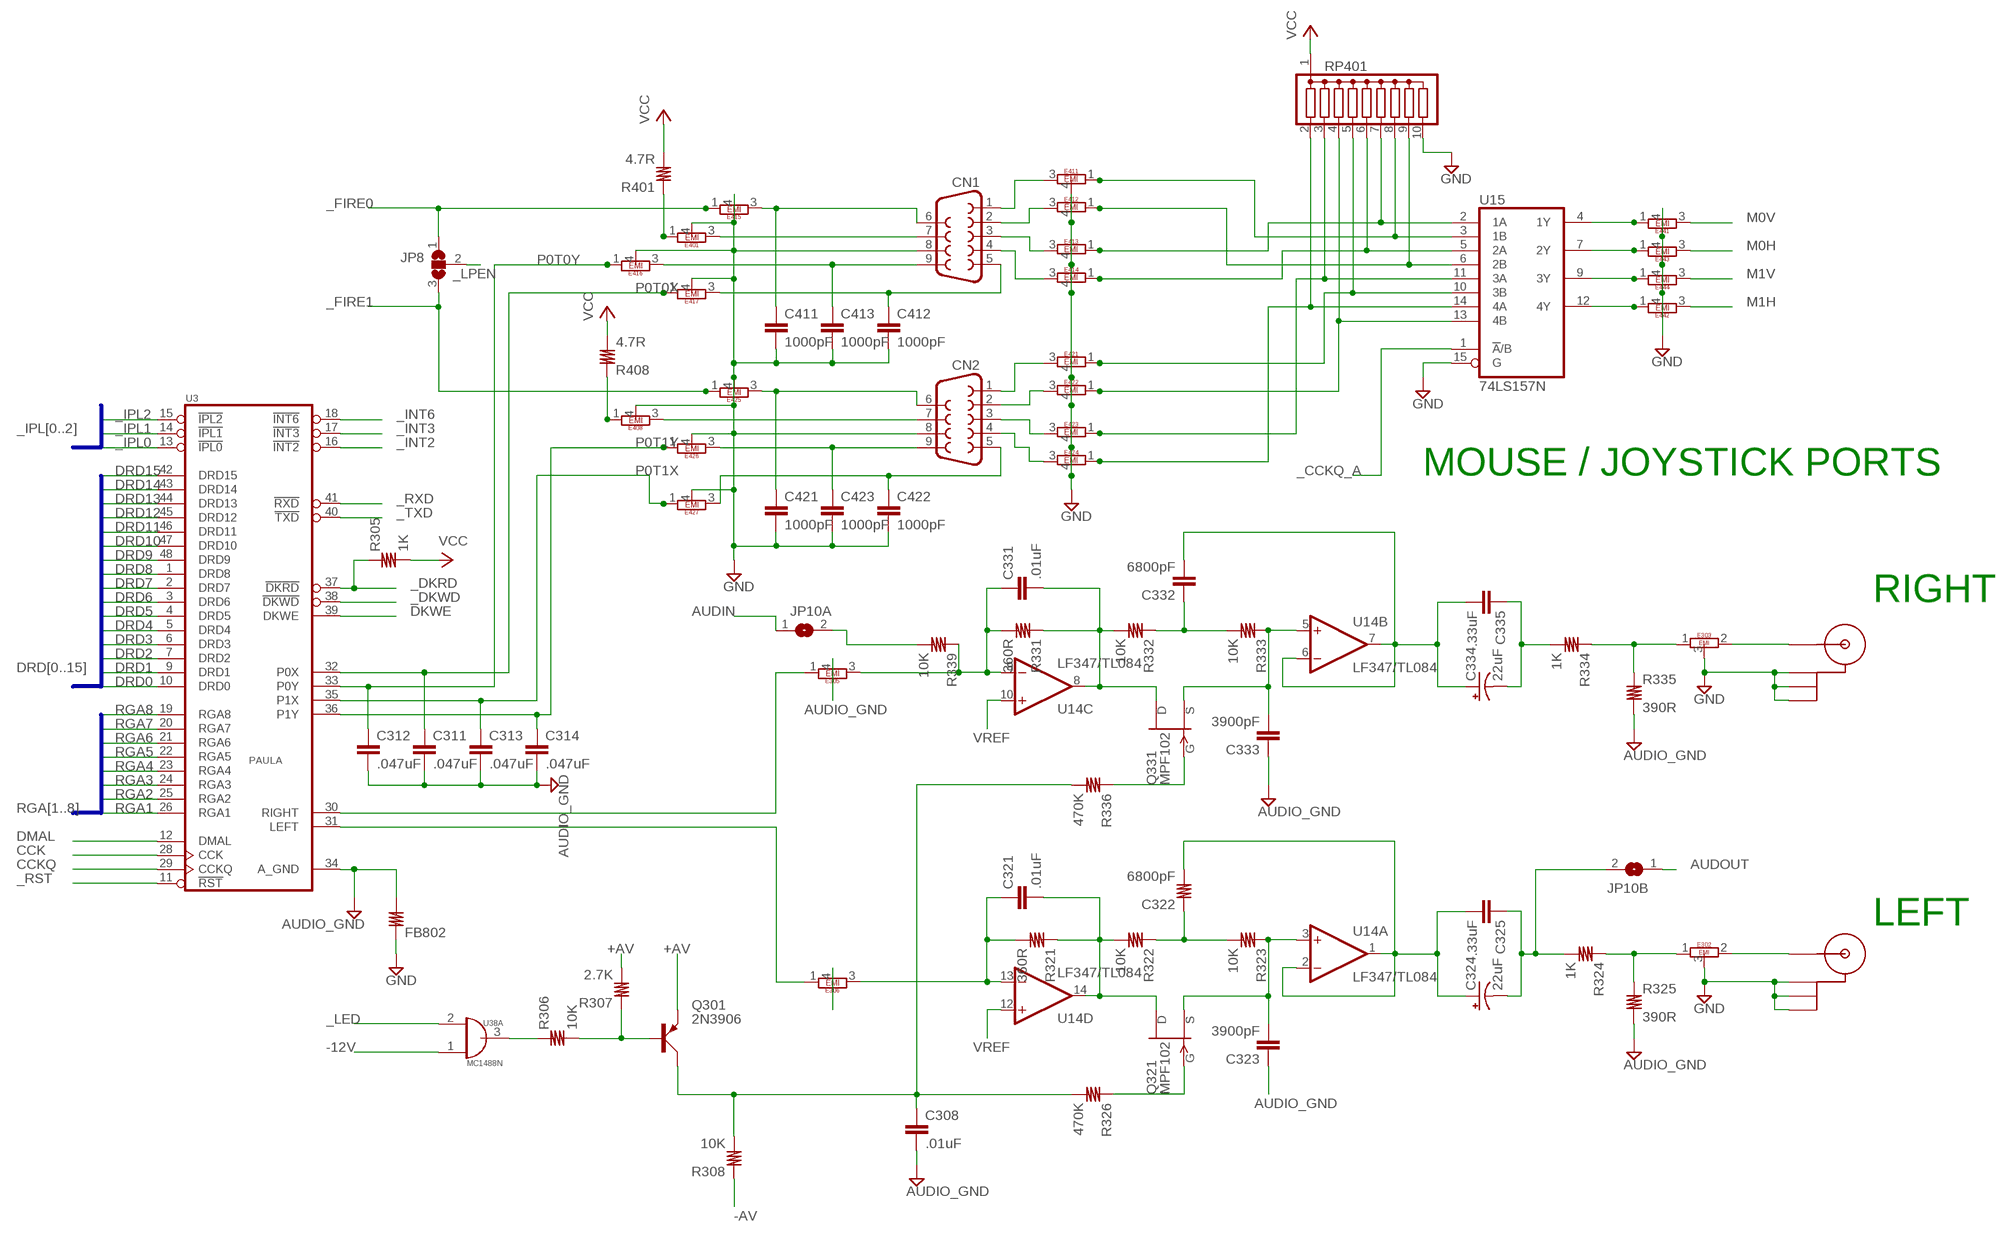
[diagram p3: schematic, sheet 4]

### Parts
C308  .01uF  C10/4  [C10B4]
C311  .047uF  C10/4  [C10B4]
C312  .047uF  C10/4  [C10B4]
C313  .047uF  C10/4  [C10B4]
C314  .047uF  C10/4  [C10B4]
C321  .01uF  C10/4  [C10B4]
C322  6800pF  R10/4  [R10B4]
C323  3900pF  C10/4  [C10B4]
C324  22uF  CPOL-USE2.5-6  [E2,5-6]
C325  .33uF  C10/4  [C10B4]
C331  .01uF  C10/4  [C10B4]
C332  6800pF  C10/4  [C10B4]
C333  3900pF  C10/4  [C10B4]
C334  22uF  CPOL-USE5-6  [E5-6]
C335  .33uF  C10/4  [C10B4]
C411  1000pF  C10/4  [C10B4]
C412  1000pF  C10/4  [C10B4]
C413  1000pF  C10/4  [C10B4]
C421  1000pF  C10/4  [C10B4]
C422  1000pF  C10/4  [C10B4]
C423  1000pF  C10/4  [C10B4]
CN1  F09HP  [F09HP]
CN2  F09HP  [F09HP]
CN3  CN4  CINCH  [CINCH-B]
CN4  CN3  CINCH  [CINCH-B]
E302  EMIFILTER  [EMIFILTER]
E303  EMIFILTER  [EMIFILTER]
E305  EMIFILTERLONG  [EMIFILTLONG]
E306  EMIFILTERLONG  [EMIFILTLONG]
E401  EMIFILTERLONG  [EMIFILTLONG]
E408  EMIFILTERLONG  [EMIFILTLONG]
E411  EMIFILTERLONG  [EMIFILTLONG]
E412  EMIFILTERLONG  [EMIFILTLONG]
E413  EMIFILTERLONG  [EMIFILTLONG]
E414  EMIFILTERLONG  [EMIFILTLONG]
E415  EMIFILTERLONG  [EMIFILTLONG]
E416  EMIFILTERLONG  [EMIFILTLONG]
E417  EMIFILTERLONG  [EMIFILTLONG]
E421  EMIFILTERLONG  [EMIFILTLONG]
E422  EMIFILTERLONG  [EMIFILTLONG]
E423  EMIFILTERLONG  [EMIFILTLONG]
E424  EMIFILTERLONG  [EMIFILTLONG]
E425  EMIFILTERLONG  [EMIFILTLONG]
E426  EMIFILTERLONG  [EMIFILTLONG]
E427  EMIFILTERLONG  [EMIFILTLONG]
E441  EMIFILTERLONG  [EMIFILTLONG]
E442  EMIFILTERLONG  [EMIFILTLONG]
E443  EMIFILTERLONG  [EMIFILTLONG]
E444  EMIFILTERLONG  [EMIFILTLONG]
FB802  R10/4  [R10B4]
JP8  SJ2W  [SJ_2]
JP10A  SJ  [SJ]
JP10B  SJ  [SJ]
Q301  2N3906  [TO92D]
Q321  MPF102  2N5485  [TO92-]
Q331  MPF102  2N5485  [TO92-]
R305  1K  R10/4  [R10B4]
R306  10K  R10/4  [R10B4]
R307  2.7K  R10/4  [R10B4]
R308  10K  R10/4  [R10B4]
R321  360R  R10/4  [R10B4]
R322  10K  R10/4  [R10B4]
R323  10K  R10/4  [R10B4]
R324  1K  R10/4  [R10B4]
R325  390R  R10/4  [R10B4]
R326  470K  R10/4  [R10B4]
R331  360R  R10/4  [R10B4]
R332  10K  R10/4  [R10B4]
R333  10K  R10/4  [R10B4]
R334  1K  R10/4  [R10B4]
R335  390R  R10/4  [R10B4]
R336  470K  R10/4  [R10B4]
R339  10K  R10/4  [R10B4]
R401  4.7R  R10/4  [R10B4]
R408  4.7R  R10/4  [R10B4]
RP401  G09R  [SIL10]
U15  74LS157N  [DIL16]
U38  MC1488N  [DIL14]

### Nets
+AV: Q301.E R307.2 ; also sheet 3
-12V: U38.1(A:OE) ; also sheet 3,5,7,8,9
-AV: R308.1 ; also sheet 3
_CCKQ_A: U15.1(!A!/B) ; also sheet 8,9
_DKRD: R305.1 U3.37(!DKRD) ; also sheet 6
_DKWD: U3.38(!DKWD) ; also sheet 1
_FIRE0: E415.1 E415.2 JP8.1 ; also sheet 5
_FIRE1: E425.1 E425.2 JP8.3 ; also sheet 5
_INT2: U3.16(!INT2) ; also sheet 5,6,8
_INT3: U3.17(!INT3) ; also sheet 1
_INT6: U3.18(!INT6) ; also sheet 5,8
_IPL0: U3.13(!IPL0) ; also sheet 1,8
_IPL1: U3.14(!IPL1) ; also sheet 1,8
_IPL2: U3.15(!IPL2) ; also sheet 1,8
_LED: U38.2(A:I) ; also sheet 5,6
_LPEN: JP8.2 ; also sheet 1
_RST: U3.11(!RST) ; also sheet 1,8
_RXD: U3.41(!RXD) ; also sheet 5
_TXD: U3.40(!TXD) ; also sheet 5
AUDIN: JP10A.1 ; also sheet 5
AUDIO_GND: C308.2 C311.2 C312.2 C313.2 C314.2 C323.1 C333.1 E305.4 E306.4 FB802.2 R325.2 R335.2 U3.34(A_GND) ; also sheet 3
AUDOUT: JP10B.1 ; also sheet 5
CCK: U3.28(CCK) ; also sheet 1,2,3,8,9
CCKQ: U3.29(CCKQ) ; also sheet 1,8,9
DKWE: U3.39(DKWE) ; also sheet 1
DMAL: U3.12(DMAL) ; also sheet 1
DRD0: U3.10(DRD0) ; also sheet 1,2,3,7,8
DRD1: U3.9(DRD1) ; also sheet 1,2,3,7,8
DRD2: U3.7(DRD2) ; also sheet 1,2,3,7,8
DRD3: U3.6(DRD3) ; also sheet 1,2,3,7,8
DRD4: U3.5(DRD4) ; also sheet 1,2,3,7,8
DRD5: U3.4(DRD5) ; also sheet 1,2,3,7,8
DRD6: U3.3(DRD6) ; also sheet 1,2,3,7,8
DRD7: U3.2(DRD7) ; also sheet 1,2,3,7,8
DRD8: U3.1(DRD8) ; also sheet 1,2,3,7,8
DRD9: U3.48(DRD9) ; also sheet 1,2,3,7,8
DRD10: U3.47(DRD10) ; also sheet 1,2,3,7,8
DRD11: U3.46(DRD11) ; also sheet 1,2,3,7,8
DRD12: U3.45(DRD12) ; also sheet 1,2,3,7,8
DRD13: U3.44(DRD13) ; also sheet 1,2,3,7,8
DRD14: U3.43(DRD14) ; also sheet 1,2,3,7,8
DRD15: U3.42(DRD15) ; also sheet 1,2,3,7,8
GND: C411.2 C412.2 C413.2 C421.2 C422.2 C423.2 CN1.8 CN2.8 CN3.P$2 CN3.P$3 CN3.P$4 CN4.P$2 CN4.P$3 CN4.P$4 E302.3 E303.3 E401.4 E408.4 E411.4 E412.4 E413.4 E414.4 E415.4 E416.4 E417.4 E421.4 E422.4 E423.4 E424.4 E425.4 E426.4 E427.4 E441.4 E442.4 E443.4 E444.4 FB802.1 RP401.10 U15.15(G) ; also sheet 1,2,3,5,6,7,8,9
M0H: E443.3 ; also sheet 3
M0V: E441.3 ; also sheet 3
M1H: E442.3 ; also sheet 3
M1V: E444.3 ; also sheet 3
N$83: E408.1 E408.2 R408.1
N$84: E401.1 E401.2 R401.1
N$85: C411.1 CN1.6 E415.3
N$86: CN1.7 E401.3
N$87: C413.1 CN1.9 E416.3
N$88: C412.1 CN1.5 E417.3
N$89: CN1.1 E411.3
N$90: C421.1 CN2.6 E425.3
N$91: CN2.7 E408.3
N$92: C423.1 CN2.9 E426.3
N$93: C422.1 CN2.5 E427.3
N$94: CN1.2 E412.3
N$95: CN1.3 E413.3
N$96: CN1.4 E414.3
N$97: CN2.1 E421.3
N$98: CN2.2 E422.3
N$99: CN2.3 E423.3
N$100: CN2.4 E424.3
N$101: E411.1 E411.2 RP401.8 U15.3(1B)
N$102: E412.1 E412.2 RP401.9 U15.6(2B)
N$103: E413.1 E413.2 RP401.7 U15.2(1A)
N$104: E414.1 E414.2 RP401.6 U15.5(2A)
N$105: E421.1 E421.2 RP401.5 U15.10(3B)
N$106: E422.1 E422.2 RP401.4 U15.13(4B)
N$107: E423.1 E423.2 RP401.3 U15.11(3A)
N$108: E424.1 E424.2 RP401.2 U15.14(4A)
N$109: E441.1 E441.2 U15.4(1Y)
N$110: E443.1 E443.2 U15.7(2Y)
N$111: E444.1 E444.2 U15.9(3Y)
N$112: E442.1 E442.2 U15.12(4Y)
N$113: R306.1 U38.3(A:O)
N$114: Q301.B R306.2 R307.1
N$115: C308.1 Q301.C R308.2 R326.2 R336.2
N$116: E306.1 E306.2 U3.31(LEFT)
N$117: E305.1 E305.2 U3.30(RIGHT)
N$118: JP10A.2 R339.2
N$119: C331.1 E305.3 R331.2 R339.1 U14.9(C:-IN)
N$120: C331.2 Q331.3(D) R331.1 R332.2 U14.8(C:OUT)
N$121: C332.1 R332.1 R333.2
N$122: Q331.1(G) R336.1
N$123: C333.2 Q331.2(S) R333.1 U14.5(B:+IN)
N$124: C332.2 C334.+ C335.2 U14.6(B:-IN) U14.7(B:OUT)
N$125: C321.1 E306.3 R321.2 U14.13(D:-IN)
N$126: C321.2 Q321.3(D) R321.1 R322.2 U14.14(D:OUT)
N$127: C322.1 R322.1 R323.2
N$128: C323.2 Q321.2(S) R323.1 U14.3(A:+IN)
N$129: C322.2 C324.+ C325.2 U14.1(A:OUT) U14.2(A:-IN)
N$130: Q321.1(G) R326.1
N$131: C324.- C325.1 JP10B.2 R324.2
N$132: E302.1 R324.1 R325.1
N$134: CN3.S E302.2
N$135: C334.- C335.1 R334.2
N$136: E303.1 R334.1 R335.1
N$137: CN4.S E303.2
P0T0X: C311.1 E417.1 E417.2 U3.32(P0X)
P0T0Y: C312.1 E416.1 E416.2 U3.33(P0Y)
P0T1X: C313.1 E427.1 E427.2 U3.35(P1X)
P0T1Y: C314.1 E426.1 E426.2 U3.36(P1Y)
RGA1: U3.26(RGA1) ; also sheet 1,3
RGA2: U3.25(RGA2) ; also sheet 1,3
RGA3: U3.24(RGA3) ; also sheet 1,3
RGA4: U3.23(RGA4) ; also sheet 1,3
RGA5: U3.22(RGA5) ; also sheet 1,3
RGA6: U3.21(RGA6) ; also sheet 1,3
RGA7: U3.20(RGA7) ; also sheet 1,3
RGA8: U3.19(RGA8) ; also sheet 1,3
VCC: R305.2 R401.2 R408.2 RP401.1 ; also sheet 1,2,3,5,6,7,8,9
VREF: U14.10(C:+IN) U14.12(D:+IN) ; also sheet 3

### Buses
_IPL[0..2]
DRD[0..15]
RGA[1..8]

### Notes on the sheet
- MOUSE / JOYSTICK PORTS
- RIGHT
- LEFT

## Sheet 5 of 9
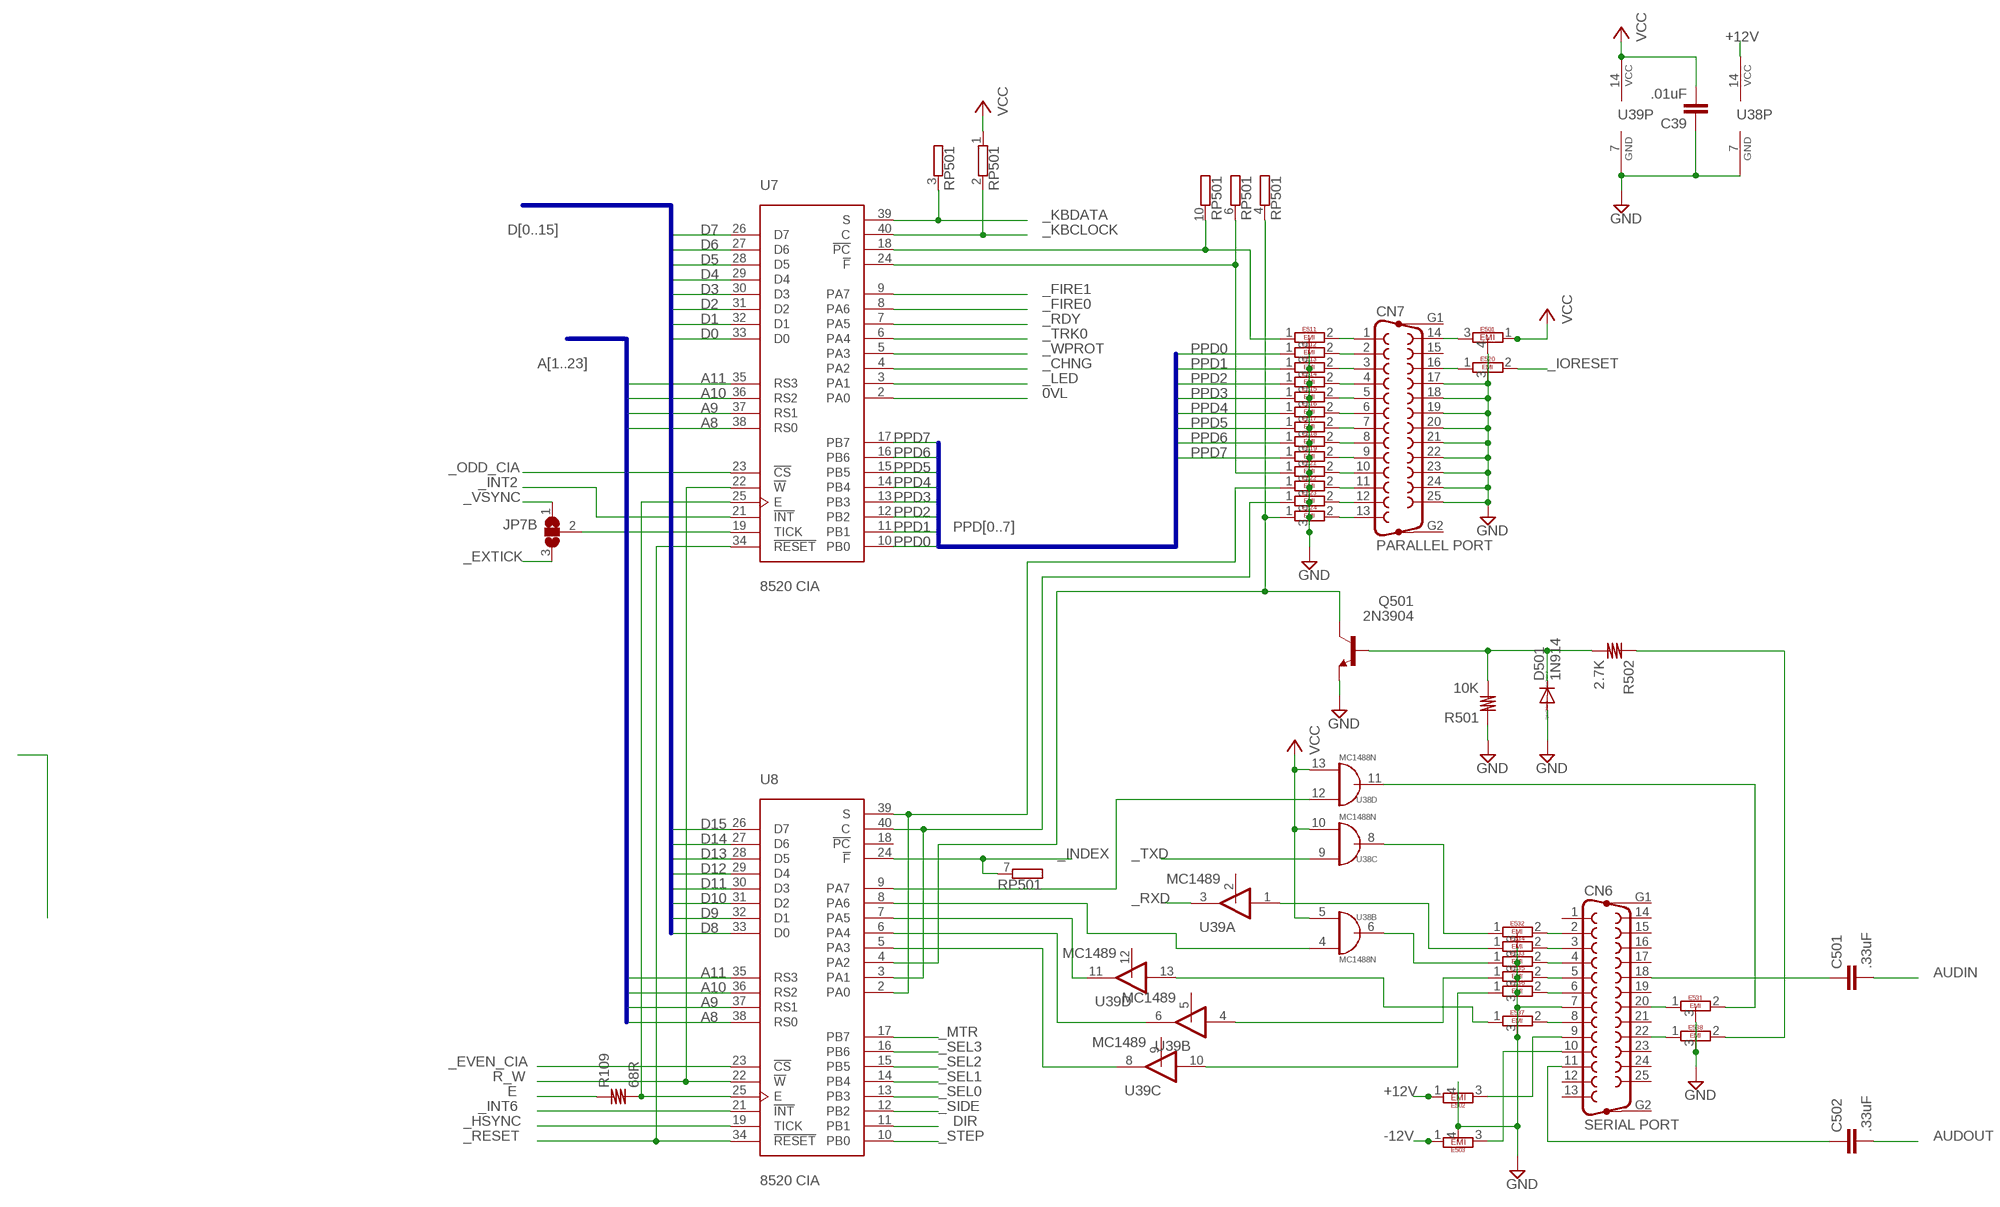
[diagram p4: schematic, sheet 5]

### Parts
C39  .01uF  C10/4  [C10B4]
C501  .33uF  C10/4  [C10B4]
C502  .33uF  C10/4  [C10B4]
CN6  SERIAL PORT  F25HP  [F25HP]
CN7  PARALLEL PORT  F25HP  [F25HP]
D501  1N914  DIODE-D-10  [D-10]
E501  47R  EMIFILTERLONG  [EMIFILTLONG]
E502  47R  EMIFILTERLONG  [EMIFILTLONG]
E503  47R  EMIFILTERLONG  [EMIFILTLONG]
E511  EMIFILTER  [EMIFILTER]
E512  EMIFILTER  [EMIFILTER]
E513  EMIFILTER  [EMIFILTER]
E514  EMIFILTER  [EMIFILTER]
E515  EMIFILTER  [EMIFILTER]
E516  EMIFILTER  [EMIFILTER]
E517  EMIFILTER  [EMIFILTER]
E518  EMIFILTER  [EMIFILTER]
E519  EMIFILTER  [EMIFILTER]
E520  EMIFILTER  [EMIFILTER]
E521  EMIFILTER  [EMIFILTER]
E522  EMIFILTER  [EMIFILTER]
E523  EMIFILTER  [EMIFILTER]
E524  EMIFILTER  [EMIFILTER]
E531  EMIFILTER  [EMIFILTER]
E532  EMIFILTER  [EMIFILTER]
E533  EMIFILTER  [EMIFILTER]
E534  EMIFILTER  [EMIFILTER]
E535  EMIFILTER  [EMIFILTER]
E536  EMIFILTER  [EMIFILTER]
E537  EMIFILTER  [EMIFILTER]
E538  EMIFILTER  [EMIFILTER]
JP7B  SJ2W  [SJ_2]
Q501  2N3904  [TO92]
R109  68R  R10/4  [R10B4]
R501  10K  R10/4  [R10B4]
R502  2.7K  R10/4  [R10B4]
RP501  GE09RP  [SIL10]
U7  8520 CIA  CIA_DIP  [DIP40-6]
U8  8520 CIA  CIA_DIP  [DIP40-6]
U39  MC1489  MC1489N  [DIL14]

### Nets
0VL: U7.2(PA0) ; also sheet 1,8
+12V: E502.1 E502.2 U38.14(P:VCC) ; also sheet 3,6,7,8,9
-12V: E503.1 E503.2 ; also sheet 3,4,7,8,9
_CHNG: U7.4(PA2) ; also sheet 6
_EVEN_CIA: U8.23(!CS) ; also sheet 1
_EXTICK: JP7B.3 ; also sheet 1,7,8
_FIRE0: U7.8(PA6) ; also sheet 4
_FIRE1: U7.9(PA7) ; also sheet 4
_HSYNC: U8.19(TICK) ; also sheet 1,3
_INDEX: RP501.7 U8.24(!F) ; also sheet 6
_INT2: U7.21(!INT) ; also sheet 4,6,8
_INT6: U8.21(!INT) ; also sheet 4,8
_IORESET: E520.2 ; also sheet 6,8
_KBCLOCK: RP501.2 U7.40(C) ; also sheet 6
_KBDATA: RP501.3 U7.39(S) ; also sheet 6
_LED: U7.3(PA1) ; also sheet 4,6
_MTR: U8.17(PB7) ; also sheet 1
_ODD_CIA: U7.23(!CS) ; also sheet 1
_RDY: U7.7(PA5) ; also sheet 6
_RESET: U7.34(!RESET) U8.34(!RESET) ; also sheet 8
_RXD: U39.3(A:O) ; also sheet 4
_SEL0: U8.13(PB3) ; also sheet 1,6
_SEL1: U8.14(PB4) ; also sheet 6
_SEL2: U8.15(PB5) ; also sheet 6
_SEL3: U8.16(PB6) ; also sheet 6
_SIDE: U8.12(PB2) ; also sheet 6
_STEP: U8.10(PB0) ; also sheet 6
_TRK0: U7.6(PA4) ; also sheet 6
_TXD: U38.9(C:I) ; also sheet 4
_VSYNC: JP7B.1 ; also sheet 1,3
_WPROT: U7.5(PA3) ; also sheet 6
A8: U7.38(RS0) U8.38(RS0) ; also sheet 1,7,8
A9: U7.37(RS1) U8.37(RS1) ; also sheet 1,7,8
A10: U7.36(RS2) U8.36(RS2) ; also sheet 1,7,8
A11: U7.35(RS3) U8.35(RS3) ; also sheet 1,7,8
AUDIN: C501.2 ; also sheet 4
AUDOUT: C502.2 ; also sheet 4
D0: U7.33(D0) ; also sheet 1,7,8
D1: U7.32(D1) ; also sheet 1,7,8
D2: U7.31(D2) ; also sheet 1,7,8
D3: U7.30(D3) ; also sheet 1,7,8
D4: U7.29(D4) ; also sheet 1,7,8
D5: U7.28(D5) ; also sheet 1,7,8
D6: U7.27(D6) ; also sheet 1,7,8
D7: U7.26(D7) ; also sheet 1,7,8
D8: U8.33(D0) ; also sheet 1,7,8
D9: U8.32(D1) ; also sheet 1,7,8
D10: U8.31(D2) ; also sheet 1,7,8
D11: U8.30(D3) ; also sheet 1,7,8
D12: U8.29(D4) ; also sheet 1,7,8
D13: U8.28(D5) ; also sheet 1,7,8
D14: U8.27(D6) ; also sheet 1,7,8
D15: U8.26(D7) ; also sheet 1,7,8
DIR: U8.11(PB1) ; also sheet 6
E: R109.1 ; also sheet 1,8
GND: C39.1 CN6.7 CN7.17 CN7.18 CN7.19 CN7.20 CN7.21 CN7.22 CN7.23 CN7.24 CN7.25 D501.A E501.4 E502.4 E503.4 E511.3 E512.3 E513.3 E514.3 E515.3 E516.3 E517.3 E518.3 E519.3 E520.3 E521.3 E522.3 E523.3 E524.3 E531.3 E532.3 E533.3 E534.3 E535.3 E536.3 E537.3 E538.3 Q501.3(E) R501.1 U38.7(P:GND) U39.7(P:GND) ; also sheet 1,2,3,4,6,7,8,9
N$57: U8.6(PA4) U39.6(B:O)
N$133: JP7B.2 U7.19(TICK)
N$139: U8.9(PA7) U38.12(D:I)
N$140: E511.1 RP501.10 U7.18(!PC)
N$141: E521.1 RP501.6 U7.24(!F)
N$142: U8.5(PA3) U39.8(C:O)
N$143: CN7.1 E511.2
N$144: CN7.2 E512.2
N$145: CN7.3 E513.2
N$146: CN7.4 E514.2
N$147: CN7.5 E515.2
N$149: CN7.6 E516.2
N$150: CN7.7 E517.2
N$151: CN7.8 E518.2
N$152: CN7.9 E519.2
N$153: CN7.10 E521.2
N$154: CN7.11 E522.2
N$155: CN7.12 E523.2
N$156: CN7.13 E524.2
N$157: E522.1 U8.2(PA0) U8.39(S)
N$158: E523.1 U8.3(PA1) U8.40(C)
N$159: E524.1 Q501.1(C) RP501.4 U8.4(PA2)
N$161: U8.7(PA5) U39.11(D:O)
N$162: U8.8(PA6) U38.4(B:OE)
N$163: E534.1 U39.1(A:OE)
N$164: E536.1 U39.10(C:OE)
N$165: E535.1 U39.4(B:OE)
N$166: E537.1 U39.13(D:OE)
N$167: U38.5(B:I) U38.10(C:OE) U38.13(D:OE) ; supply symbol labelled VCC
N$168: CN6.8 E537.2
N$169: E531.2 U38.11(D:O)
N$170: CN6.2 E532.2
N$171: CN6.3 E534.2
N$172: CN6.4 E533.2
N$173: CN6.5 E535.2
N$174: CN6.6 E536.2
N$175: E532.1 U38.8(C:O)
N$176: CN6.20 E531.1
N$177: CN6.22 E538.1
N$178: E538.2 R502.1
N$179: C501.1 CN6.18
N$180: C502.1 CN6.11
N$181: E533.1 U38.6(B:O)
N$182: CN6.9 E502.3
N$183: CN7.16 E520.1
N$184: D501.C Q501.2(B) R501.2 R502.2
N$185: CN6.10 E503.3
N$186: CN7.14 E501.3
N$999: R109.2 U7.25(E) U8.25(E)
PPD0: E512.1 U7.10(PB0)
PPD1: E513.1 U7.11(PB1)
PPD2: E514.1 U7.12(PB2)
PPD3: E515.1 U7.13(PB3)
PPD4: E516.1 U7.14(PB4)
PPD5: E517.1 U7.15(PB5)
PPD6: E518.1 U7.16(PB6)
PPD7: E519.1 U7.17(PB7)
R_W: U7.22(!W) U8.22(!W) ; also sheet 1,8
VCC: C39.2 E501.1 E501.2 RP501.1 U39.14(P:VCC) ; also sheet 1,2,3,4,6,7,8,9
Unconnected: CN6.1 CN6.12 CN6.13 CN6.14 CN6.15 CN6.16 CN6.17 CN6.19 CN6.21 CN6.23 CN6.24 CN6.25 CN6.G1 CN6.G2 CN7.15 CN7.G1 CN7.G2 U8.18(!PC) U39.2(A:I) U39.5(B:I) U39.9(C:I) U39.12(D:I)

### Buses
D[0..15]
A[1..23]
PPD[0..7]

## Sheet 6 of 9
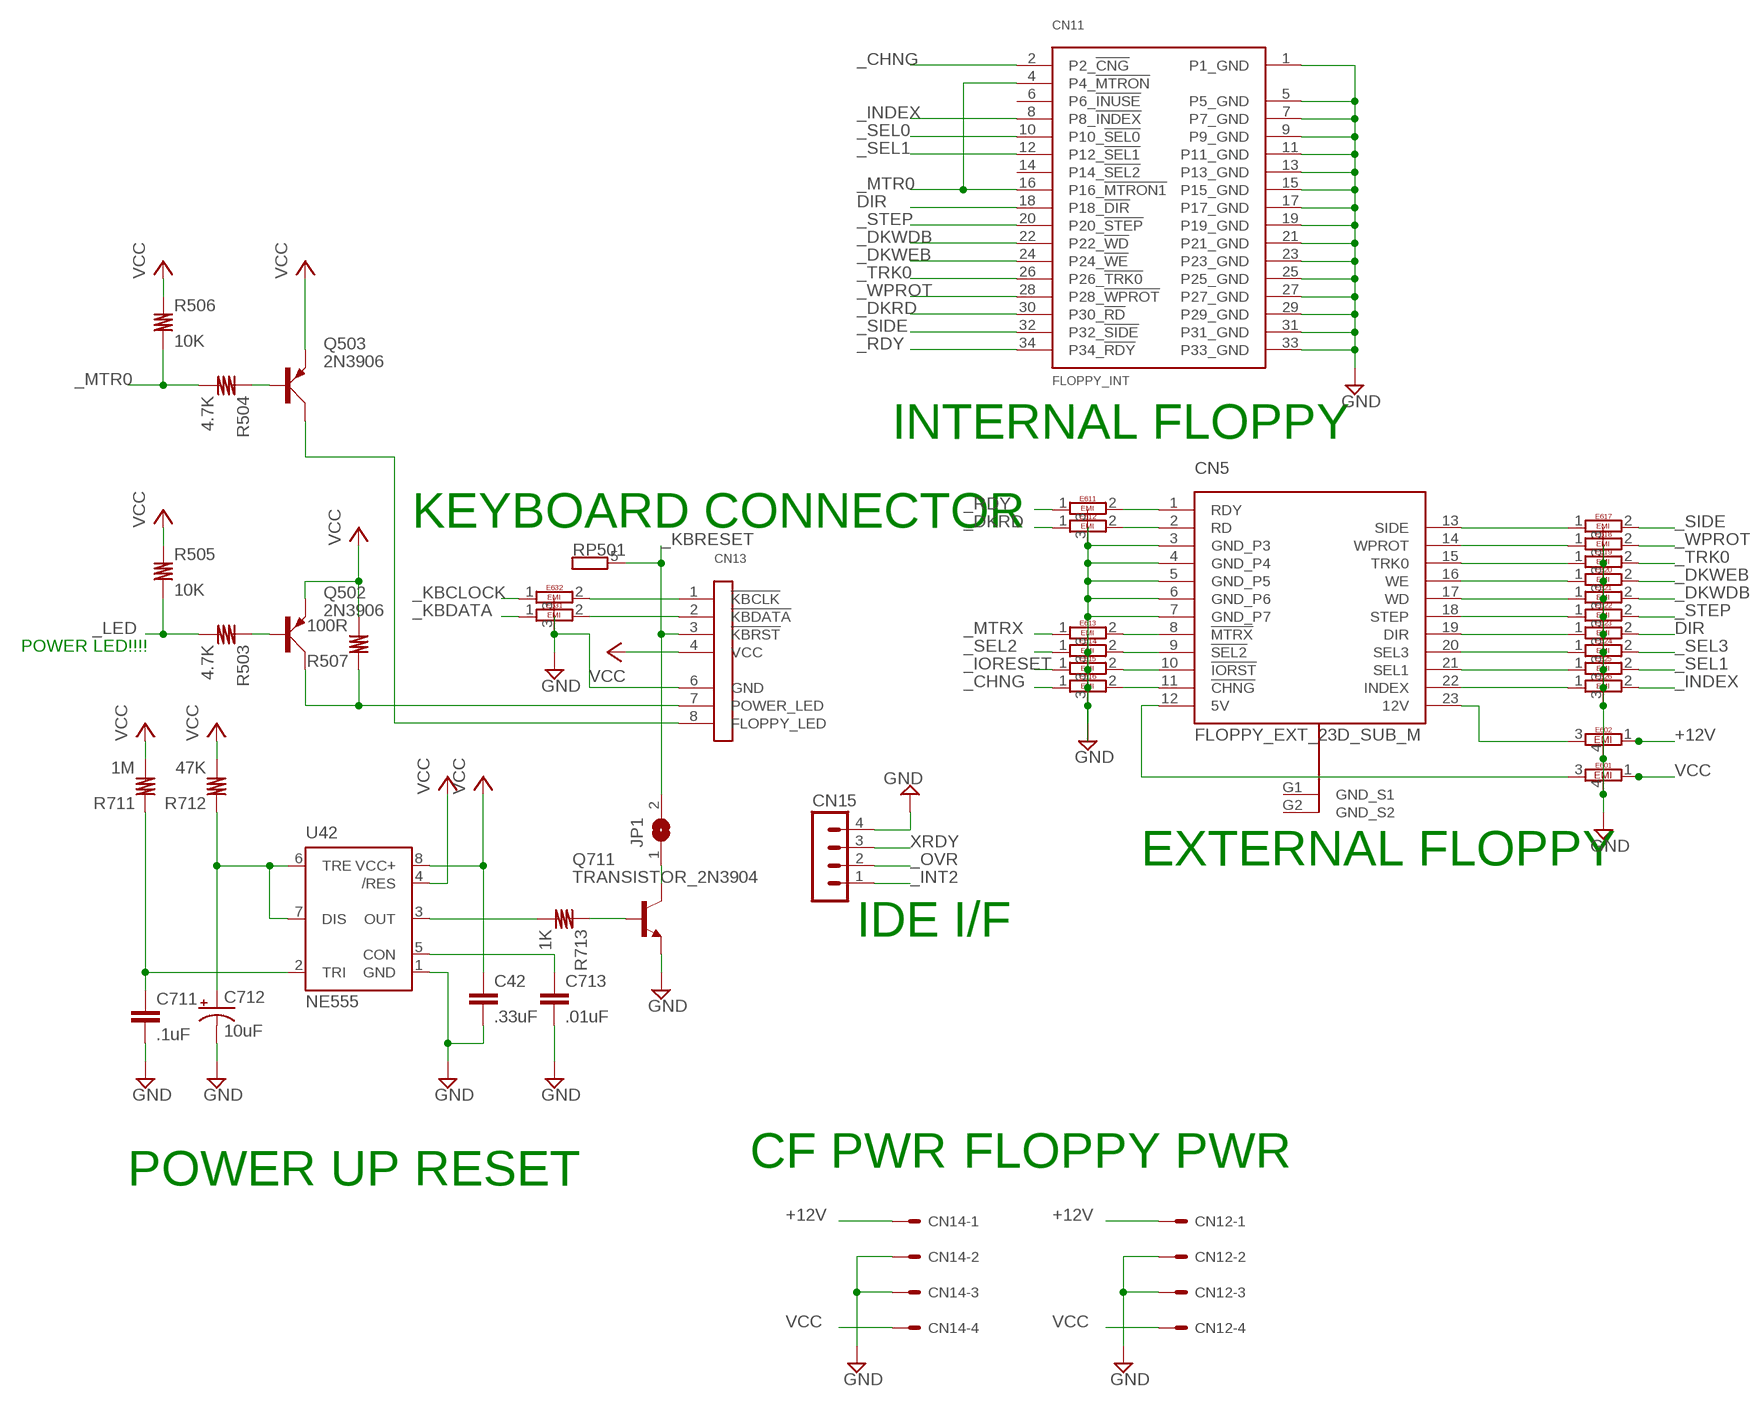
[diagram p5: schematic, sheet 6]

### Parts
C42  .33uF  C10/4  [C10B4]
C711  .1uF  C10/4  [C10B4]
C712  10uF  CPOL-USE5-6  [E5-6]
C713  .01uF  C10/4  [C10B4]
CN5  FLOPPY_EXT_23D_SUB_M  [M23H_FC]
CN11  FLOPPY_INT  [2X17M]
CN12  22-27-2041-04  [6410-04]
CN13  KB_A500  [1X08S]
CN14  22-27-2041-04  [6410-04]
CN15  MA04-1  [MA04-1]
E601  EMIFILTERLONG  [EMIFILTLONG]
E602  EMIFILTERLONG  [EMIFILTLONG]
E611  EMIFILTER  [EMIFILTER]
E612  EMIFILTER  [EMIFILTER]
E613  EMIFILTER  [EMIFILTER]
E614  EMIFILTER  [EMIFILTER]
E615  EMIFILTER  [EMIFILTER]
E616  EMIFILTER  [EMIFILTER]
E617  EMIFILTER  [EMIFILTER]
E618  EMIFILTER  [EMIFILTER]
E619  EMIFILTER  [EMIFILTER]
E620  EMIFILTER  [EMIFILTER]
E621  EMIFILTER  [EMIFILTER]
E622  EMIFILTER  [EMIFILTER]
E623  EMIFILTER  [EMIFILTER]
E624  EMIFILTER  [EMIFILTER]
E625  EMIFILTER  [EMIFILTER]
E626  EMIFILTER  [EMIFILTER]
E631  EMIFILTER  [EMIFILTER]
E632  EMIFILTER  [EMIFILTER]
JP1  SJ  [SJ]
Q502  2N3906  [TO92D]
Q503  2N3906  [TO92D]
Q711  TRANSISTOR_2N3904  [TRANSISTOR_TO92-ECB]
R503  4.7K  R10/4  [R10B4]
R504  4.7K  R10/4  [R10B4]
R505  10K  R10/4  [R10B4]
R506  10K  R10/4  [R10B4]
R507  100R  R10/4  [R10B4]
R711  1M  R10/4  [R10B4]
R712  47K  R10/4  [R10B4]
R713  1K  R10/4  [R10B4]
U42  NE555  [DIL-08]

### Nets
+12V: CN12.1 CN14.1 E602.1 E602.2 ; also sheet 3,5,7,8,9
_CHNG: CN11.2(P2_!CNG!) E616.1 ; also sheet 5
_DKRD: CN11.30(P30_!RD) E612.1 ; also sheet 4
_DKWDB: CN11.22(P22_!WD) E621.2 ; also sheet 1
_DKWEB: CN11.24(P24_!WE) E620.2 ; also sheet 1
_INDEX: CN11.8(P8_!INDEX!) E626.2 ; also sheet 5
_INT2: CN15.1 ; also sheet 4,5,8
_IORESET: E615.1 ; also sheet 5,8
_KBCLOCK: E632.1 ; also sheet 5
_KBDATA: E631.1 ; also sheet 5
_KBRESET: CN13.3(!KBRST) JP1.2 RP501.5 ; also sheet 1
_LED: R503.2 R505.2 ; also sheet 4,5
_MTR0: CN11.4(P4_!MTRON) CN11.16(P16_!MTRON1) R504.2 R506.2 ; also sheet 1
_MTRX: E613.1 ; also sheet 1
_OVR: CN15.2
_RDY: CN11.34(P34_!RDY) E611.1 ; also sheet 5
_SEL0: CN11.10(P10_!SEL0) ; also sheet 1,5
_SEL1: CN11.12(P12_!SEL1) E625.2 ; also sheet 5
_SEL2: E614.1 ; also sheet 5
_SEL3: E624.2 ; also sheet 5
_SIDE: CN11.32(P32_!SIDE) E617.2 ; also sheet 5
_STEP: CN11.20(P20_!STEP) E622.2 ; also sheet 5
_TRK0: CN11.26(P26_!TRK0) E619.2 ; also sheet 5
_WPROT: CN11.28(P28_!WPROT) E618.2 ; also sheet 5
DIR: CN11.18(P18_!DIR) E623.2 ; also sheet 5
GND: C42.2 C711.2 C712.- C713.2 CN5.3(GND_P3) CN5.4(GND_P4) CN5.5(GND_P5) CN5.6(GND_P6) CN5.7(GND_P7) CN11.1(P1_GND) CN11.5(P5_GND) CN11.7(P7_GND) CN11.9(P9_GND) CN11.11(P11_GND) CN11.13(P13_GND) CN11.15(P15_GND) CN11.17(P17_GND) CN11.19(P19_GND) CN11.21(P21_GND) CN11.23(P23_GND) CN11.25(P25_GND) CN11.27(P27_GND) CN11.29(P29_GND) CN11.31(P31_GND) CN11.33(P33_GND) CN12.2 CN12.3 CN14.2 CN14.3 CN15.4 E601.4 E602.4 E611.3 E612.3 E613.3 E614.3 E615.3 E616.3 E617.3 E618.3 E619.3 E620.3 E621.3 E622.3 E623.3 E624.3 E625.3 E626.3 E631.3 E632.3 Q711.1(E) U42.1(GND) ; also sheet 1,2,3,4,5,7,8,9
N$187: C711.1 R711.1 U42.2(TRI)
N$188: C712.+ R712.1 U42.6(TRE) U42.7(DIS)
N$189: R713.2 U42.3(OUT)
N$190: C713.1 U42.5(CON)
N$191: Q711.2(B) R713.1
N$193: JP1.1 Q711.3(C)
N$194: CN13.6(GND)
N$195: CN13.1(!KBCLK) E632.2
N$196: CN13.2(!KBDATA) E631.2
N$197: CN13.7(POWER_LED) Q502.C R507.1
N$200: Q502.B R503.1
N$201: CN13.8(FLOPPY_LED) Q503.C
N$202: Q503.B R504.1
N$204: CN5.8(!MTRX!) E613.2
N$205: CN5.23(12V) E602.3
N$206: CN5.12(5V) E601.3
N$207: CN5.13(SIDE) E617.1
N$208: CN5.14(WPROT) E618.1
N$209: CN5.15(TRK0) E619.1
N$210: CN5.16(WE) E620.1
N$211: CN5.17(WD) E621.1
N$212: CN5.18(STEP) E622.1
N$213: CN5.19(DIR) E623.1
N$214: CN5.20(SEL3) E624.1
N$215: CN5.21(SEL1) E625.1
N$216: CN5.22(INDEX) E626.1
N$227: CN5.2(RD) E612.2
N$228: CN5.1(RDY) E611.2
N$229: CN5.9(!SEL2!) E614.2
N$230: CN5.10(!IORST!) E615.2
N$231: CN5.11(!CHNG!) E616.2
VCC: C42.1 CN12.4 CN13.4(VCC) CN14.4 E601.1 E601.2 Q502.E Q503.E R505.1 R506.1 R507.2 R711.2 R712.2 U42.4(/RES) U42.8(VCC+) ; also sheet 1,2,3,4,5,7,8,9
XRDY: CN15.3 ; also sheet 8
Unconnected: CN11.6(P6_!INUSE!) CN11.14(P14_!SEL2)

### Notes on the sheet
- INTERNAL FLOPPY
- KEYBOARD CONNECTOR
- POWER LED!!!!
- EXTERNAL FLOPPY
- IDE I/F
- CF PWR | FLOPPY PWR
- POWER UP RESET

## Sheet 7 of 9
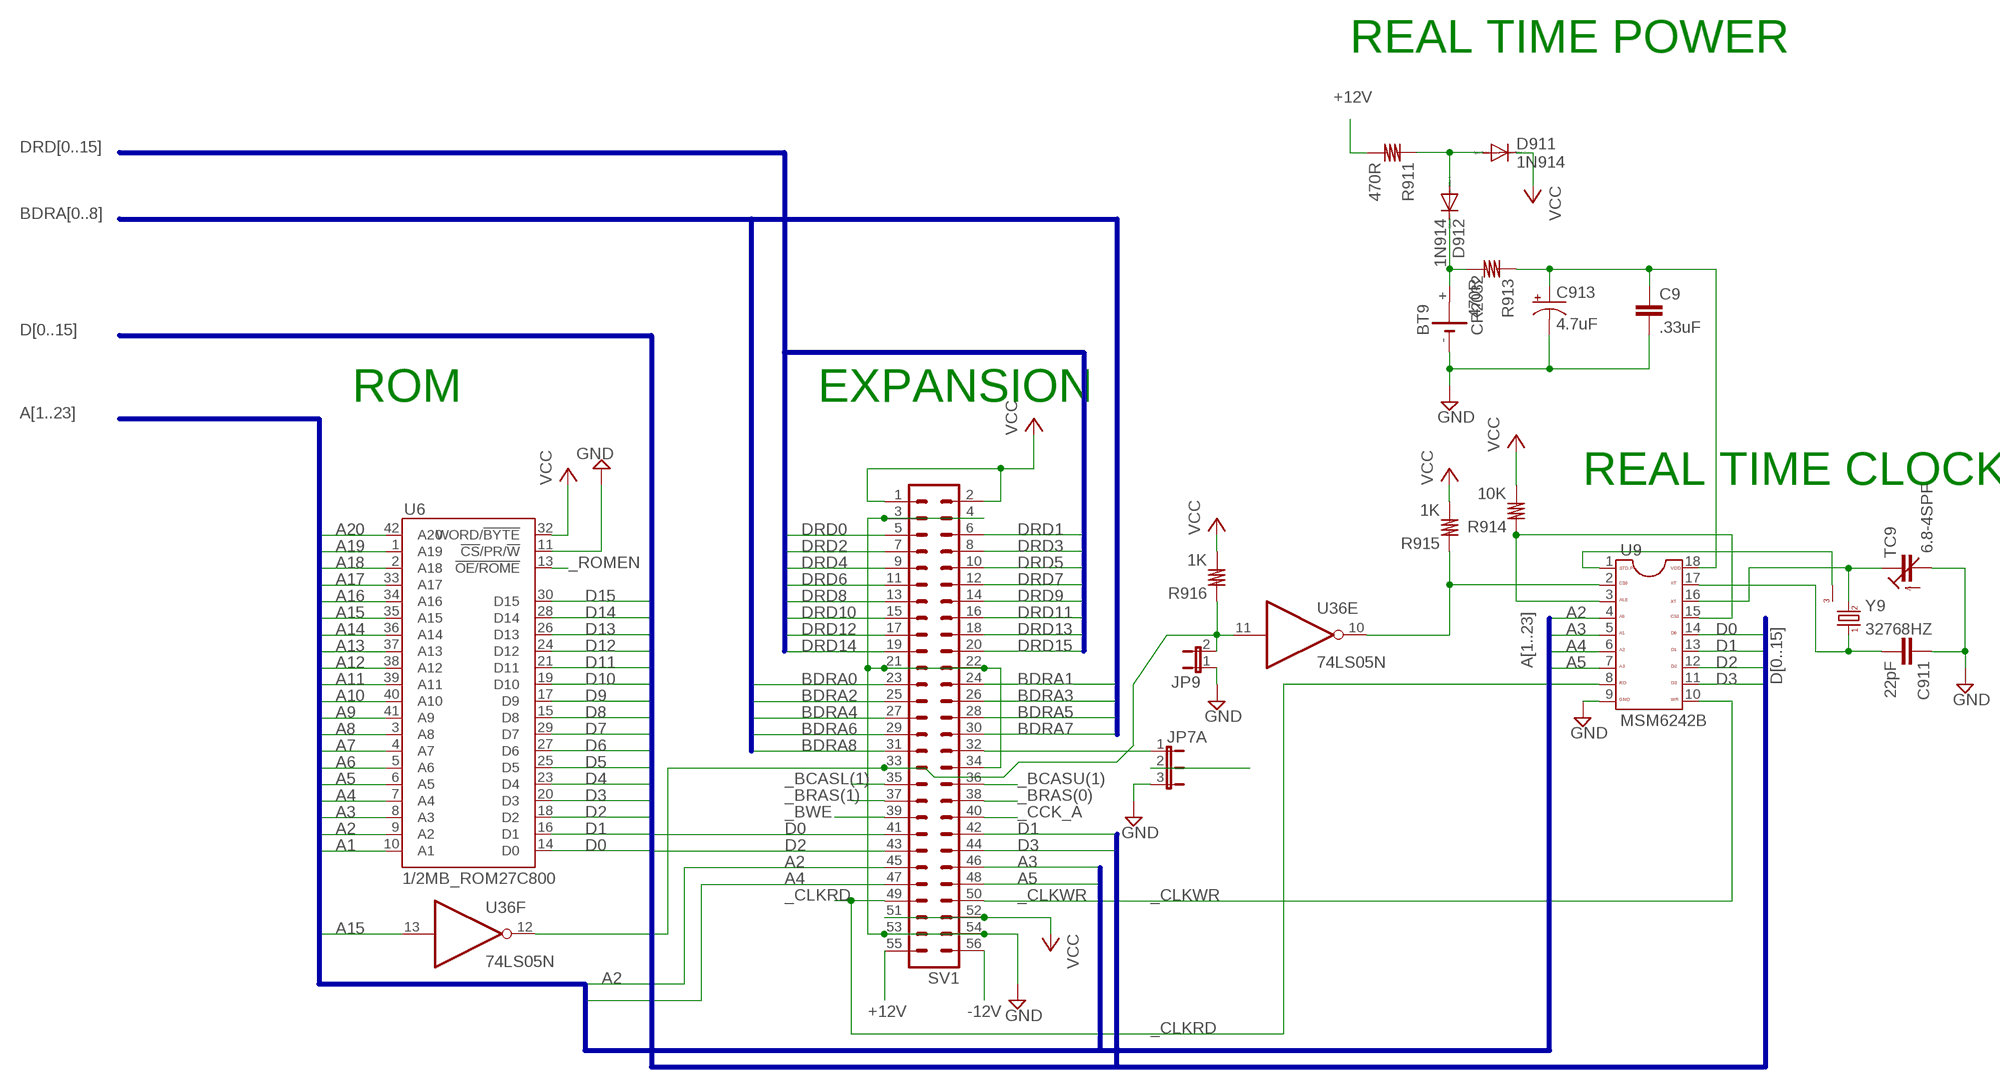
[diagram p6: schematic, sheet 7]

### Parts
BT9  CR2032  CR2032H  [CR2032H]
C9  .33uF  C10/4  [C10B4]
C911  22pF  C10/4  [C10B4]
C913  4.7uF  CPOL-USE5-6  [E5-6]
D911  1N914  1N4004  [DO41-10]
D912  1N914  1N4004  [DO41-10]
JP7A  JP2E  [JP2]
JP9  JP1E  [JP1]
R911  470R  R10/4  [R10B4]
R913  470R  R10/4  [R10B4]
R914  10K  R10/4  [R10B4]
R915  1K  R10/4  [R10B4]
R916  1K  R10/4  [R10B4]
SV1  AMIGA56  [AMIGA56]
TC9  6.8-4SPF  C-TRIMM3050.504  [CTRIM3050.504]
U6  1/2MB_ROM27C800  [DIP42-6]
U9  MSM6242B  [DIL18]
Y9  32768HZ  CLKCRYSTAL  [HC49TL-H]

### Nets
+12V: R911.2 SV1.55 ; also sheet 3,5,6,8,9
-12V: SV1.56 ; also sheet 3,4,5,8,9
_BCASL(1): SV1.35 ; also sheet 2
_BCASU(1): SV1.36 ; also sheet 2
_BRAS(0): SV1.38 ; also sheet 2
_BRAS(1): SV1.37 ; also sheet 2
_BWE: SV1.39 ; also sheet 2
_CCK_A: SV1.40 ; also sheet 8,9
_CLKRD: SV1.49 U9.8 ; also sheet 1
_CLKWR: SV1.50 U9.10 ; also sheet 1
_EXTICK: JP7A.2 ; also sheet 1,5,8
_ROMEN: U6.13(!OE/ROME) ; also sheet 1
A1: U6.10(A1) ; also sheet 1,8
A2: SV1.45 U6.9(A2) U9.4 ; also sheet 1,8
A3: SV1.46 U6.8(A3) U9.5 ; also sheet 1,8
A4: SV1.47 U6.7(A4) U9.6 ; also sheet 1,8
A5: SV1.48 U6.6(A5) U9.7 ; also sheet 1,8
A6: U6.5(A6) ; also sheet 1,8
A7: U6.4(A7) ; also sheet 1,8
A8: U6.3(A8) ; also sheet 1,5,8
A9: U6.41(A9) ; also sheet 1,5,8
A10: U6.40(A10) ; also sheet 1,5,8
A11: U6.39(A11) ; also sheet 1,5,8
A12: U6.38(A12) ; also sheet 1,8
A13: U6.37(A13) ; also sheet 1,8
A14: U6.36(A14) ; also sheet 1,8
A15: U6.35(A15) U36.13(F:I) ; also sheet 1,8
A16: U6.34(A16) ; also sheet 1,8
A17: U6.33(A17) ; also sheet 1,8
A18: U6.2(A18) ; also sheet 1,8
A19: U6.1(A19) ; also sheet 1,8
A20: U6.42(A20) ; also sheet 1,8
BDRA0: SV1.23 ; also sheet 2
BDRA1: SV1.24 ; also sheet 2
BDRA2: SV1.25 ; also sheet 2
BDRA3: SV1.26 ; also sheet 2
BDRA4: SV1.27 ; also sheet 2
BDRA5: SV1.28 ; also sheet 2
BDRA6: SV1.29 ; also sheet 2
BDRA7: SV1.30 ; also sheet 2
BDRA8: SV1.31 ; also sheet 2
D0: SV1.41 U6.14(D0) U9.14 ; also sheet 1,5,8
D1: SV1.42 U6.16(D1) U9.13 ; also sheet 1,5,8
D2: SV1.43 U6.18(D2) U9.12 ; also sheet 1,5,8
D3: SV1.44 U6.20(D3) U9.11 ; also sheet 1,5,8
D4: U6.23(D4) ; also sheet 1,5,8
D5: U6.25(D5) ; also sheet 1,5,8
D6: U6.27(D6) ; also sheet 1,5,8
D7: U6.29(D7) ; also sheet 1,5,8
D8: U6.15(D8) ; also sheet 1,5,8
D9: U6.17(D9) ; also sheet 1,5,8
D10: U6.19(D10) ; also sheet 1,5,8
D11: U6.21(D11) ; also sheet 1,5,8
D12: U6.24(D12) ; also sheet 1,5,8
D13: U6.26(D13) ; also sheet 1,5,8
D14: U6.28(D14) ; also sheet 1,5,8
D15: U6.30(D15) ; also sheet 1,5,8
DRD0: SV1.5 ; also sheet 1,2,3,4,8
DRD1: SV1.6 ; also sheet 1,2,3,4,8
DRD2: SV1.7 ; also sheet 1,2,3,4,8
DRD3: SV1.8 ; also sheet 1,2,3,4,8
DRD4: SV1.9 ; also sheet 1,2,3,4,8
DRD5: SV1.10 ; also sheet 1,2,3,4,8
DRD6: SV1.11 ; also sheet 1,2,3,4,8
DRD7: SV1.12 ; also sheet 1,2,3,4,8
DRD8: SV1.13 ; also sheet 1,2,3,4,8
DRD9: SV1.14 ; also sheet 1,2,3,4,8
DRD10: SV1.15 ; also sheet 1,2,3,4,8
DRD11: SV1.16 ; also sheet 1,2,3,4,8
DRD12: SV1.17 ; also sheet 1,2,3,4,8
DRD13: SV1.18 ; also sheet 1,2,3,4,8
DRD14: SV1.19 ; also sheet 1,2,3,4,8
DRD15: SV1.20 ; also sheet 1,2,3,4,8
GND: BT9.- C9.2 C911.1 C913.- JP7A.3 JP9.1 SV1.3 SV1.4 SV1.21 SV1.22 SV1.34 SV1.53 SV1.54 TC9.2(A) U6.11(!CS!/PR/!W!) U9.9 ; also sheet 1,2,3,4,5,6,8,9
N$233: JP9.2 R916.1 SV1.33 U36.11(E:I) U36.12(F:O)
N$234: JP7A.1 SV1.32
N$235: R915.1 U9.2 U36.10(E:O)
N$238: BT9.+ D912.C R913.2
N$239: D911.A D912.A R911.1
N$240: C9.1 C913.+ R913.1 U9.18
N$241: U9.1 Y9.3
N$242: TC9.1(E) U9.16 Y9.2
N$243: R914.1 U9.3 U9.15
N$244: C911.2 U9.17 Y9.1
VCC: D911.C R914.2 R915.2 R916.2 SV1.1 SV1.2 SV1.51 SV1.52 U6.32(WORD/!BYTE) ; also sheet 1,2,3,4,5,6,8,9
Unconnected: BT9.+@1(+)

### Buses
DRD[0..15]
BDRA[0..8]
D[0..15]
A[1..23]

### Notes on the sheet
- REAL TIME POWER
- ROM | EXPANSION
- REAL TIME CLOCK

## Sheet 8 of 9
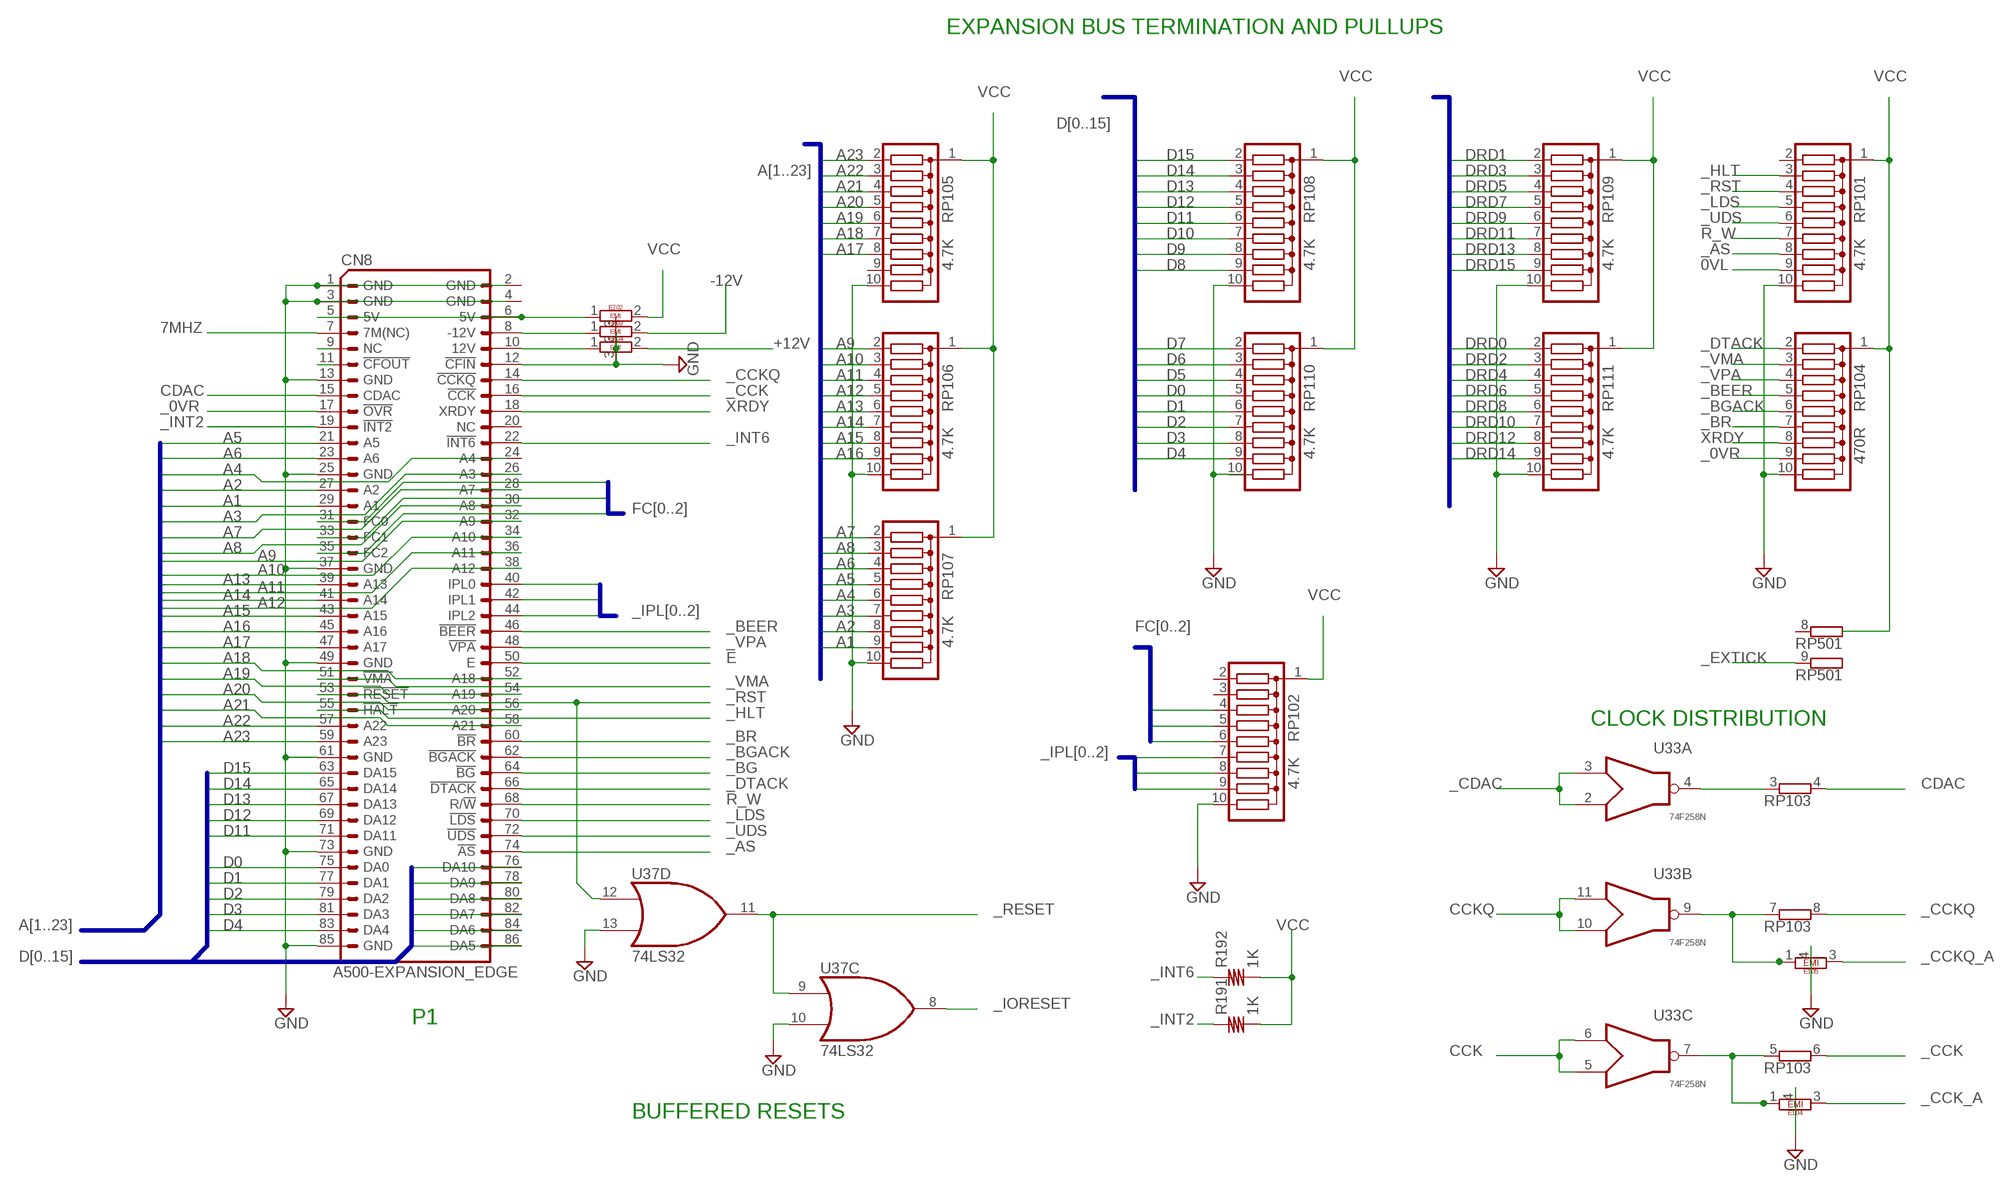
[diagram p7: schematic, sheet 8]

### Parts
CN8  A500-EXPANSION_EDGE  [LKONT_43]
E104  EMIFILTERLONG  [EMIFILTLONG]
E105  EMIFILTERLONG  [EMIFILTLONG]
E702  EMIFILTER  [EMIFILTER]
E703  EMIFILTER  [EMIFILTER]
E704  EMIFILTER  [EMIFILTER]
R191  1K  R10/4  [R10B4]
R192  1K  R10/4  [R10B4]
RP101  4.7K  G09R  [SIL10]
RP102  4.7K  G09R  [SIL10]
RP103  E5RP  [SIL10]
RP104  470R  G09R  [SIL10]
RP105  4.7K  G09R  [SIL10]
RP106  4.7K  G09R  [SIL10]
RP107  4.7K  G09R  [SIL10]
RP108  4.7K  G09R  [SIL10]
RP109  4.7K  G09R  [SIL10]
RP110  4.7K  G09R  [SIL10]
RP111  4.7K  G09R  [SIL10]

### Nets
0VL: RP101.9 ; also sheet 1,5
7MHZ: CN8.7(7M(NC)) ; also sheet 1,9
+12V: E704.2 ; also sheet 3,5,6,7,9
-12V: E703.2 ; also sheet 3,4,5,7,9
_0VR: CN8.17(!OVR!) RP104.9 ; also sheet 1
_AS: CN8.74(!AS!) RP101.8 ; also sheet 1
_BEER: CN8.46(!BEER!) RP104.5 ; also sheet 1
_BG: CN8.64(!BG!) ; also sheet 1
_BGACK: CN8.62(!BGACK!) RP104.6 ; also sheet 1
_BR: CN8.60(!BR!) RP104.7 ; also sheet 1
_CCK: CN8.16(!CCK!) RP103.6 ; also sheet 9
_CCK_A: E104.3 ; also sheet 7,9
_CCKQ: CN8.14(!CCKQ!) RP103.8 ; also sheet 9
_CCKQ_A: E105.3 ; also sheet 4,9
_CDAC: U33.2(A:I1) U33.3(A:I0) ; also sheet 1,3,9
_DTACK: CN8.66(!DTACK!) RP104.2 ; also sheet 1
_EXTICK: RP501.9 ; also sheet 1,5,7
_HLT: CN8.55(!HALT!) RP101.3 ; also sheet 1
_INT2: CN8.19(!INT2!) R191.1 ; also sheet 4,5,6
_INT6: CN8.22(!INT6!) R192.1 ; also sheet 4,5
_IORESET: U37.8(C:O) ; also sheet 5,6
_IPL0: CN8.40(IPL0) RP102.7 ; also sheet 1,4
_IPL1: CN8.42(IPL1) RP102.8 ; also sheet 1,4
_IPL2: CN8.44(IPL2) RP102.9 ; also sheet 1,4
_LDS: CN8.70(!LDS!) RP101.5 ; also sheet 1
_RESET: U37.9(C:I0) U37.11(D:O) ; also sheet 5
_RST: CN8.53(!RESET!) RP101.4 U37.12(D:I0) ; also sheet 1,4
_UDS: CN8.72(!UDS!) RP101.6 ; also sheet 1
_VMA: CN8.51(!VMA!) RP104.3 ; also sheet 1
_VPA: CN8.48(!VPA!) RP104.4 ; also sheet 1
A1: CN8.29(A1) RP107.9 ; also sheet 1,7
A2: CN8.27(A2) RP107.8 ; also sheet 1,7
A3: CN8.26(A3) RP107.7 ; also sheet 1,7
A4: RP107.6 ; also sheet 1,7
A5: CN8.21(A5) RP107.5 ; also sheet 1,7
A6: CN8.23(A6) RP107.4 ; also sheet 1,7
A7: CN8.28(A7) RP107.2 ; also sheet 1,7
A8: CN8.30(A8) RP107.3 ; also sheet 1,5,7
A9: CN8.32(A9) RP106.2 ; also sheet 1,5,7
A10: CN8.34(A10) RP106.3 ; also sheet 1,5,7
A11: CN8.36(A11) RP106.4 ; also sheet 1,5,7
A12: CN8.38(A12) RP106.5 ; also sheet 1,7
A13: CN8.39(A13) RP106.6 ; also sheet 1,7
A14: CN8.41(A14) RP106.7 ; also sheet 1,7
A15: CN8.43(A15) RP106.8 ; also sheet 1,7
A16: CN8.45(A16) RP106.9 ; also sheet 1,7
A17: CN8.47(A17) RP105.8 ; also sheet 1,7
A18: CN8.52(A18) RP105.7 ; also sheet 1,7
A19: CN8.54(A19) RP105.6 ; also sheet 1,7
A20: CN8.56(A20) RP105.5 ; also sheet 1,7
A21: CN8.58(A21) RP105.4 ; also sheet 1
A22: CN8.57(A22) RP105.3 ; also sheet 1
A23: CN8.59(A23) RP105.2 ; also sheet 1
CCK: U33.5(C:I1) U33.6(C:I0) ; also sheet 1,2,3,4,9
CCKQ: U33.10(B:I1) U33.11(B:I0) ; also sheet 1,4,9
CDAC: CN8.15(CDAC) RP103.4 ; also sheet 9
D0: CN8.75(DA0) RP110.5 ; also sheet 1,5,7
D1: CN8.77(DA1) RP110.6 ; also sheet 1,5,7
D2: CN8.79(DA2) RP110.7 ; also sheet 1,5,7
D3: CN8.81(DA3) RP110.8 ; also sheet 1,5,7
D4: CN8.83(DA4) RP110.9 ; also sheet 1,5,7
D5: CN8.86(DA5) RP110.4 ; also sheet 1,5,7
D6: CN8.84(DA6) RP110.3 ; also sheet 1,5,7
D7: CN8.82(DA7) RP110.2 ; also sheet 1,5,7
D8: CN8.80(DA8) RP108.9 ; also sheet 1,5,7
D9: CN8.78(DA9) RP108.8 ; also sheet 1,5,7
D10: CN8.76(DA10) RP108.7 ; also sheet 1,5,7
D11: CN8.71(DA11) RP108.6 ; also sheet 1,5,7
D12: CN8.69(DA12) RP108.5 ; also sheet 1,5,7
D13: CN8.67(DA13) RP108.4 ; also sheet 1,5,7
D14: CN8.65(DA14) RP108.3 ; also sheet 1,5,7
D15: CN8.63(DA15) RP108.2 ; also sheet 1,5,7
DRD0: RP111.2 ; also sheet 1,2,3,4,7
DRD1: RP109.2 ; also sheet 1,2,3,4,7
DRD2: RP111.3 ; also sheet 1,2,3,4,7
DRD3: RP109.3 ; also sheet 1,2,3,4,7
DRD4: RP111.4 ; also sheet 1,2,3,4,7
DRD5: RP109.4 ; also sheet 1,2,3,4,7
DRD6: RP111.5 ; also sheet 1,2,3,4,7
DRD7: RP109.5 ; also sheet 1,2,3,4,7
DRD8: RP111.6 ; also sheet 1,2,3,4,7
DRD9: RP109.6 ; also sheet 1,2,3,4,7
DRD10: RP111.7 ; also sheet 1,2,3,4,7
DRD11: RP109.7 ; also sheet 1,2,3,4,7
DRD12: RP111.8 ; also sheet 1,2,3,4,7
DRD13: RP109.8 ; also sheet 1,2,3,4,7
DRD14: RP111.9 ; also sheet 1,2,3,4,7
DRD15: RP109.9 ; also sheet 1,2,3,4,7
E: CN8.50(E) ; also sheet 1,5
FC0: CN8.31(FC0) RP102.4 ; also sheet 1
FC1: CN8.33(FC1) RP102.5 ; also sheet 1
FC2: CN8.35(FC2) RP102.6 ; also sheet 1
GND: CN8.1(GND) CN8.3(GND) CN8.12(!CFIN!) CN8.13(GND) CN8.25(GND) CN8.37(GND) CN8.49(GND) CN8.61(GND) CN8.73(GND) CN8.85(GND) E104.4 E105.4 E702.3 E703.3 E704.3 RP101.10 RP102.10 RP104.10 RP105.10 RP106.10 RP107.10 RP108.10 RP109.10 RP111.10 U37.10(C:I1) U37.13(D:I1) ; also sheet 1,2,3,4,5,6,7,9
N$245: CN8.9(NC)
N$246: CN8.11(!CFOUT!)
N$247: CN8.5(5V) CN8.6(5V) E702.1
N$248: RP103.3 U33.4(A:O)
N$249: CN8.8(-12V) E703.1
N$250: CN8.10(12V) E704.1
N$251: E105.1 E105.2 RP103.7 U33.9(B:O)
N$252: E104.1 E104.2 RP103.5 U33.7(C:O)
R_W: CN8.68(R/!W!) RP101.7 ; also sheet 1,5
VCC: E702.2 R191.2 R192.2 RP101.1 RP102.1 RP104.1 RP105.1 RP106.1 RP107.1 RP108.1 RP109.1 RP110.1 RP111.1 ; also sheet 1,2,3,4,5,6,7,9
XRDY: CN8.18(XRDY) RP104.8 ; also sheet 6
Unconnected: CN8.2(GND) CN8.4(GND) CN8.20(NC) CN8.24(A4) RP101.2 RP102.2 RP102.3 RP105.9 RP110.10 RP501.8

### Buses
A[1..23]
D[0..15]
_IPL[0..2]
FC[0..2]
DRD[0..15]

### Notes on the sheet
- EXPANSION BUS TERMINATION AND PULLUPS
- CLOCK DISTRIBUTION
- P1
- BUFFERED RESETS

## Sheet 9 of 9
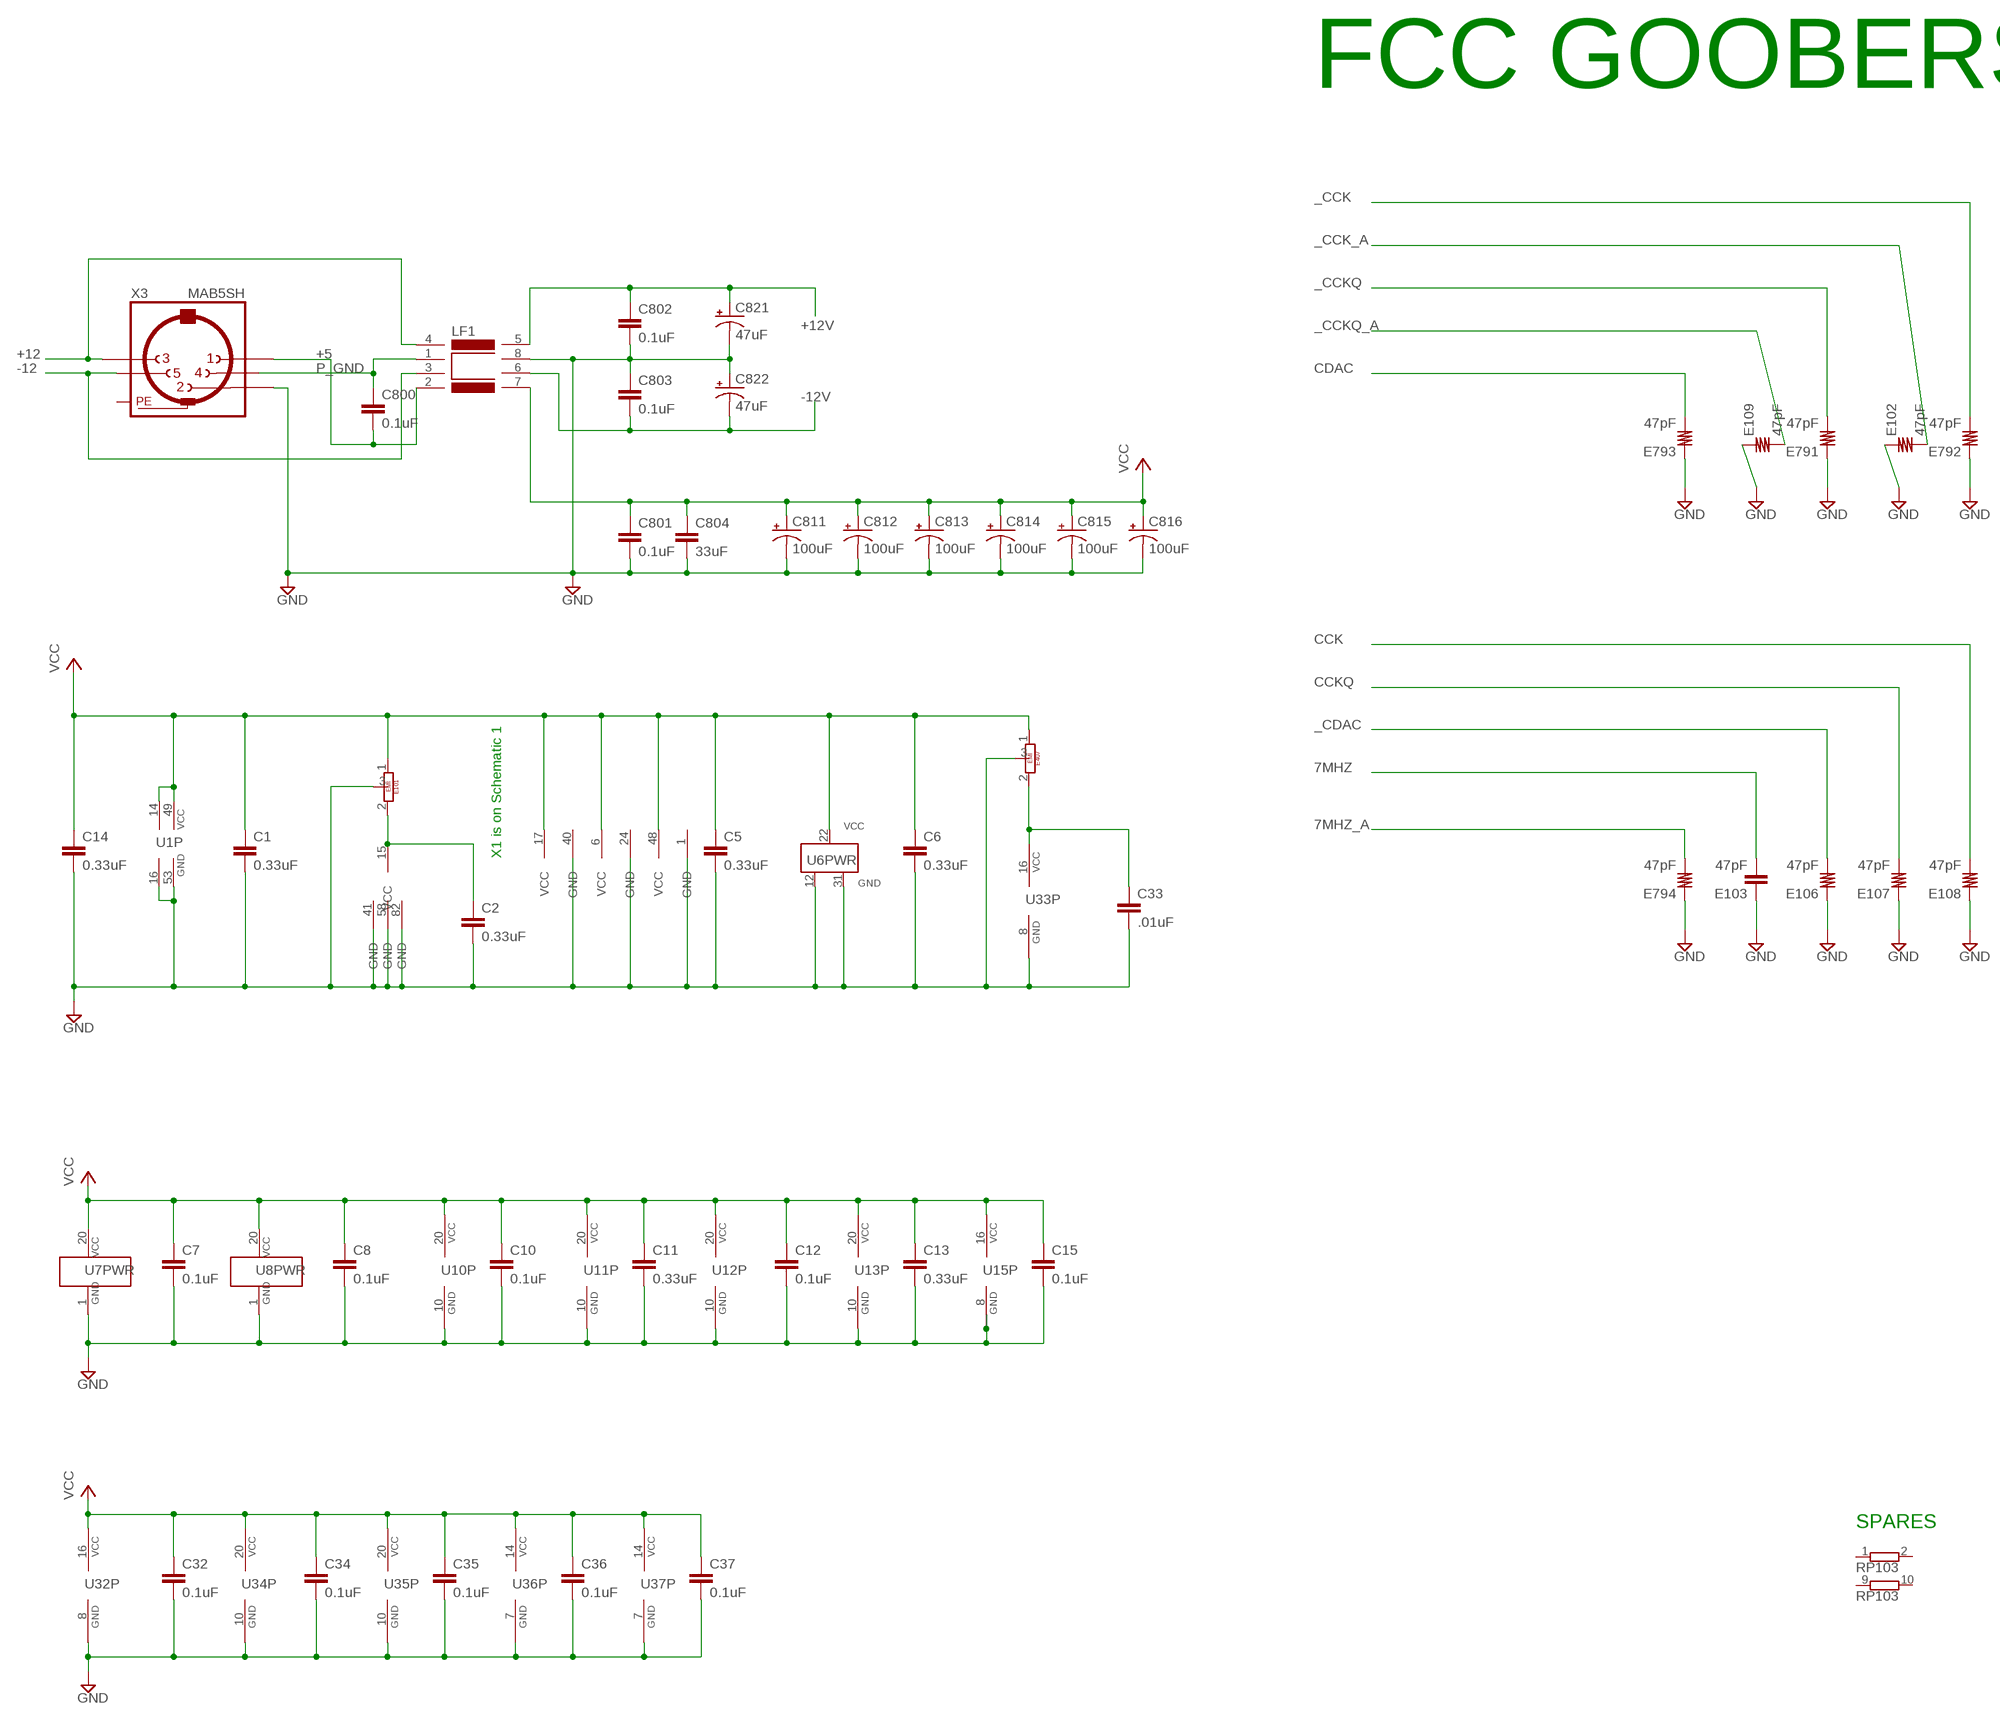
[diagram p8: schematic, sheet 9]

### Parts
C1  0.33uF  C10/4  [C10B4]
C2  0.33uF  C10/4  [C10B4]
C5  0.33uF  C10/4  [C10B4]
C6  0.33uF  C10/4  [C10B4]
C7  0.1uF  C10/4  [C10B4]
C8  0.1uF  C10/4  [C10B4]
C10  0.1uF  C10/4  [C10B4]
C11  0.33uF  C10/4  [C10B4]
C12  0.1uF  C10/4  [C10B4]
C13  0.33uF  C10/4  [C10B4]
C14  0.33uF  C10/4  [C10B4]
C15  0.1uF  C10/4  [C10B4]
C32  0.1uF  C10/4  [C10B4]
C33  .01uF  C10/4  [C10B4]
C34  0.1uF  C10/4  [C10B4]
C35  0.1uF  C10/4  [C10B4]
C36  0.1uF  C10/4  [C10B4]
C37  0.1uF  C10/4  [C10B4]
C800  0.1uF  C10/4  [C10B4]
C801  0.1uF  C10/4  [C10B4]
C802  0.1uF  C10/4  [C10B4]
C803  0.1uF  C10/4  [C10B4]
C804  33uF  C10/4  [C10B4]
C811  100uF  CPOL-USE5-6  [E5-6]
C812  100uF  CPOL-USE5-6  [E5-6]
C813  100uF  CPOL-USE5-6  [E5-6]
C814  100uF  CPOL-USE5-6  [E5-6]
C815  100uF  CPOL-USE5-6  [E5-6]
C816  100uF  CPOL-USE5-6  [E5-6]
C821  47uF  CPOL-USE5-6  [E5-6]
C822  47uF  CPOL-USE5-6  [E5-6]
E101  .01uF  EMIFILTER  [EMIFILTER]
E102  47pF  R10/4  [R10B4]
E103  47pF  C10/4  [C10B4]
E106  47pF  R10/4  [R10B4]
E107  47pF  R10/4  [R10B4]
E108  47pF  R10/4  [R10B4]
E109  47pF  R10/4  [R10B4]
E407  .01uF  EMIFILTER  [EMIFILTER]
E791  47pF  R10/4  [R10B4]
E792  47pF  R10/4  [R10B4]
E793  47pF  R10/4  [R10B4]
E794  47pF  R10/4  [R10B4]
LF1  AMIGALINEFILTER  [DK31]
X3  MAB5SH  [MAB5SH]

### Nets
7MHZ: E103.2 ; also sheet 1,8
7MHZ_A: E794.2 ; also sheet 1,3
+5: C800.2 LF1.2 X3.1
+12: LF1.4 X3.3
+12V: C802.1 C821.+ LF1.5 ; also sheet 3,5,6,7,8
-12: LF1.3 X3.5
-12V: C803.2 C822.- LF1.6 ; also sheet 3,4,5,7,8
_CCK: E792.2 ; also sheet 8
_CCK_A: E102.2 ; also sheet 7,8
_CCKQ: E791.2 ; also sheet 8
_CCKQ_A: E109.2 ; also sheet 4,8
_CDAC: E106.2 ; also sheet 1,3,8
CCK: E108.2 ; also sheet 1,2,3,4,8
CCKQ: E107.2 ; also sheet 1,4,8
CDAC: E793.2 ; also sheet 8
GND: C1.2 C2.2 C5.2 C6.2 C7.2 C8.2 C10.2 C11.2 C12.2 C13.2 C14.2 C15.2 C32.2 C33.2 C34.2 C35.2 C36.2 C37.2 C801.2 C802.2 C803.1 C804.2 C811.- C812.- C813.- C814.- C815.- C816.- C821.- C822.+ E101.3 E102.1 E103.1 E106.1 E107.1 E108.1 E109.1 E407.3 E791.1 E792.1 E793.1 E794.1 LF1.8 U1.16(GND) U1.53(GND) U6.12(GND) U6.31(GND) U7.1(GND1) U8.1(GND1) U10.10(GND) U11.10(GND) U12.10(GND) U13.10(GND) U15.8(GND) U32.8(P:GND) U33.8(P:GND) U34.10(GND) U35.10(P:GND) U36.7(P:GND) U37.7(P:GND) X3.2 ; also sheet 1,2,3,4,5,6,7,8
N$253: C2.1 E101.2 U2.15(VCC)
N$256: C33.1 E407.2 U33.16(P:VCC)
P_GND: C800.1 LF1.1 X3.4
VCC: C1.1 C5.1 C6.1 C7.1 C8.1 C10.1 C11.1 C12.1 C13.1 C14.1 C15.1 C32.1 C34.1 C35.1 C36.1 C37.1 C801.1 C804.1 C811.+ C812.+ C813.+ C814.+ C815.+ C816.+ E101.1 E407.1 LF1.7 U1.14(VCC) U1.49(VCC) U5.6(VCC) U5.17(VCC) U5.48(VCC) U6.22(VCC) U7.20(VCC1) U8.20(VCC1) U10.20(VCC) U11.20(VCC) U12.20(VCC) U13.20(VCC) U15.16(VCC) U32.16(P:VCC) U34.20(VCC) U35.20(P:VCC) U36.14(P:VCC) U37.14(P:VCC) ; also sheet 1,2,3,4,5,6,7,8
Unconnected: RP103.1 RP103.2 RP103.9 RP103.10

### Notes on the sheet
- FCC GOOBERS
- X1 is on Schematic 1
- SPARES

## Power pins joined to a net without a drawn wire
GND: U2.41(GND) U2.58(GND) U2.82(GND) U5.1(GND) U5.24(GND) U5.40(GND)
GND_S1: CN5.G1(GND_S1) CN9.G1(GND_S1)
GND_S2: CN5.G2(GND_S2) CN9.G2(GND_S2)
PE: X3.PE X3.PE@(PE)